# Altium project ESE516_A2_Thinking.PrjPcb (part 1 of 2)
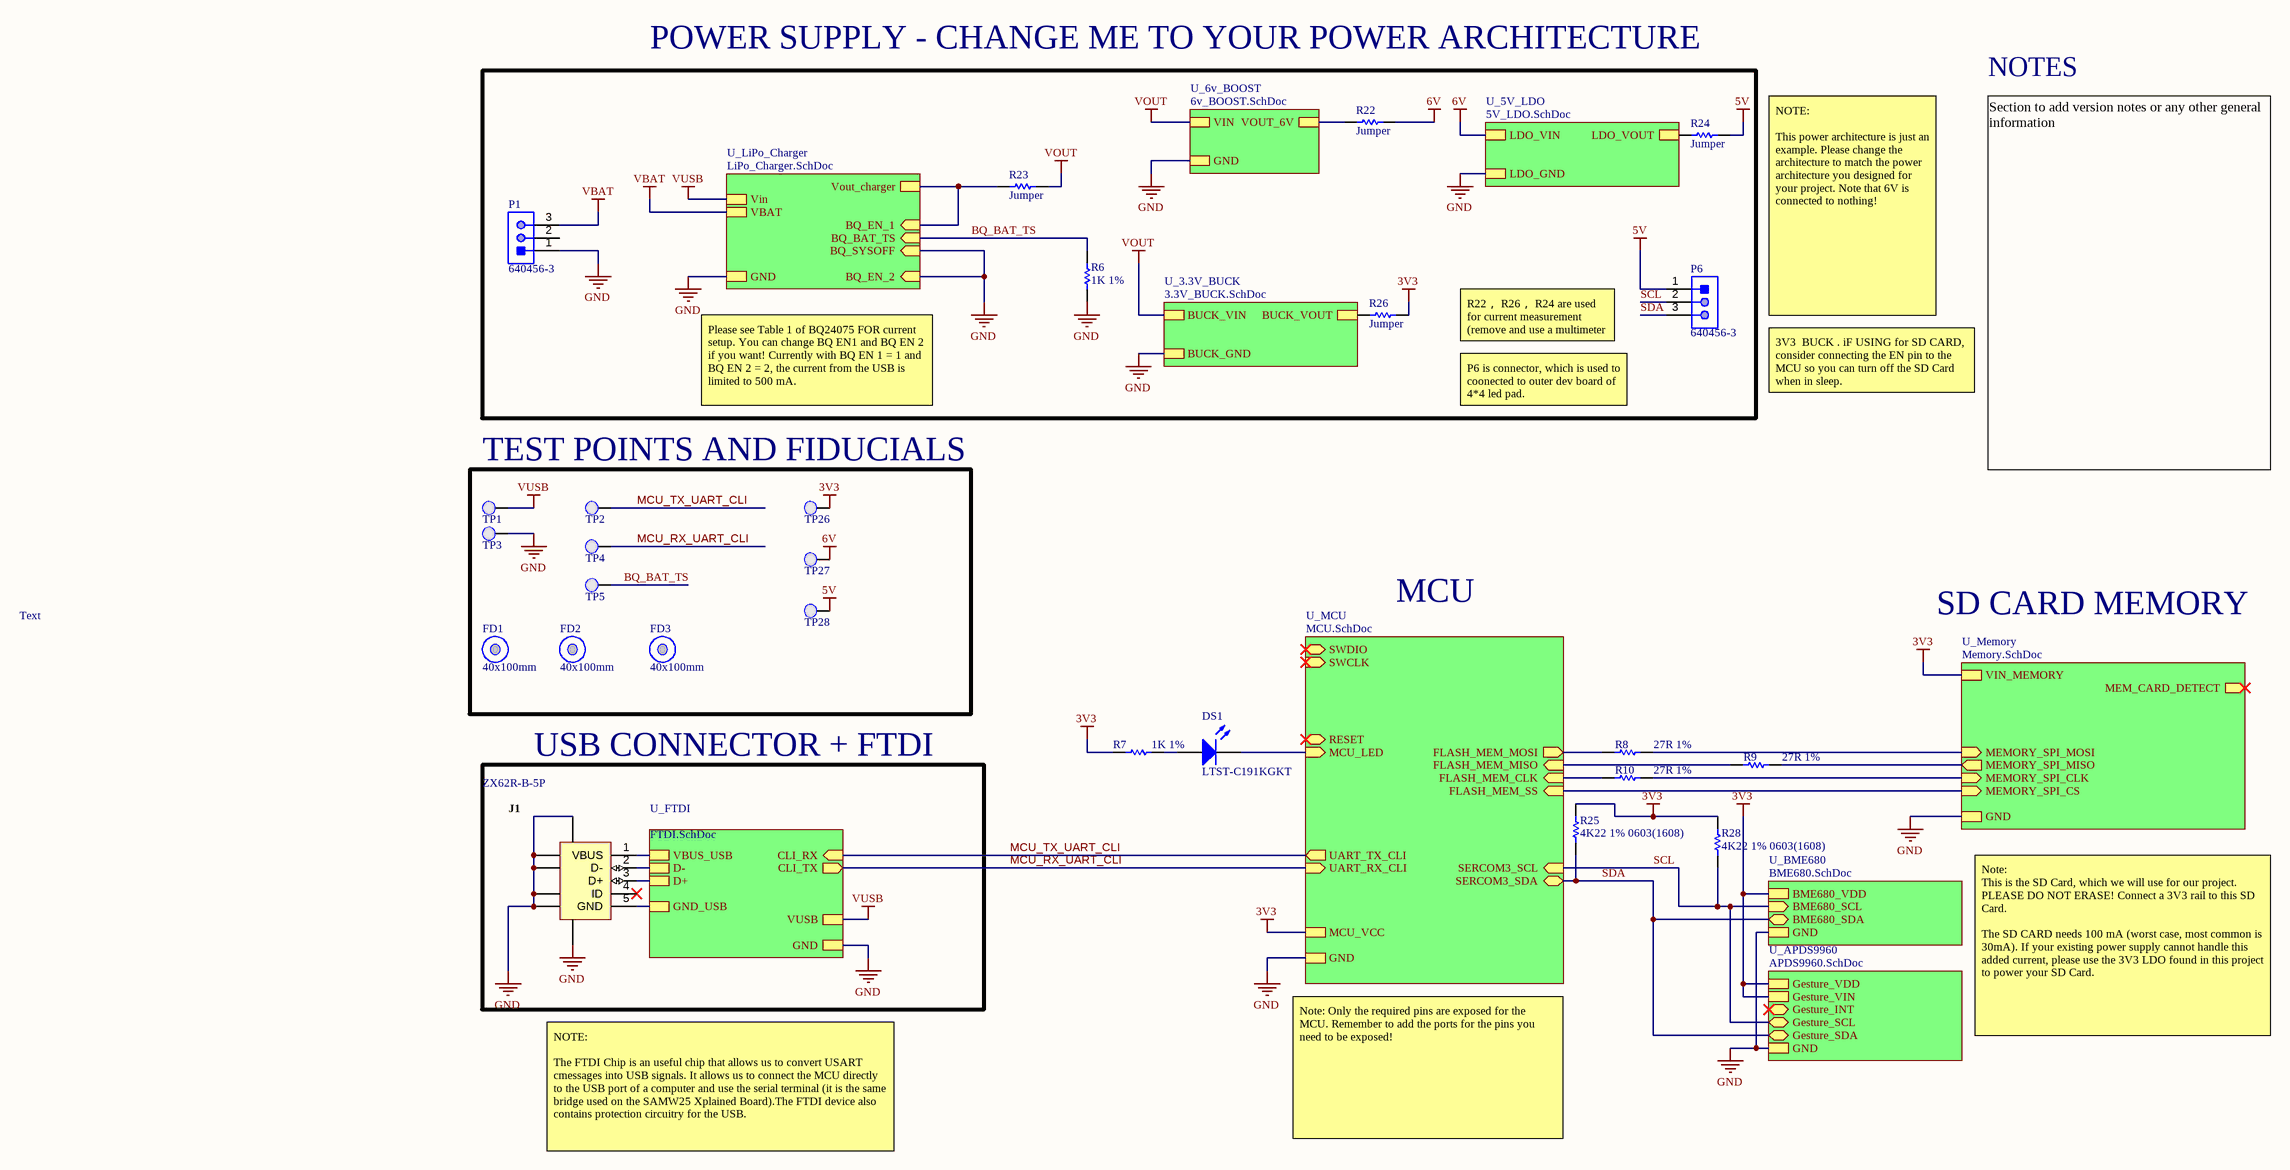
[diagram p0: MAIN.SchDoc]
10 sheets, 116 parts. Net scope: strictly hierarchical (ports join the sheet entries above them; power ports are local).
Board file: ESE516_PCB.PcbDoc
Sheets:
  MAIN.SchDoc
    U_FTDI = FTDI.SchDoc
    U_MCU = MCU.SchDoc
    U_Memory = Memory.SchDoc
    U_LiPo_Charger = LiPo_Charger.SchDoc
    U_6v_BOOST = 6v_BOOST.SchDoc
    U_BME680 = BME680.SchDoc
    U_APDS9960 = APDS9960.SchDoc
    U_3.3V_BUCK = 3.3V_BUCK.SchDoc
    U_5V_LDO = 5V_LDO.SchDoc

## Sheet MAIN.SchDoc: Main.SchDoc
size 558 x 431 mm; Date: 2/16/2022; Author: Xitong Zheng, Hongliang Chen; SheetNumber: 1; SheetTotal: 11

### Parts
DS1  LTST-C191KGKT  [LITE-ON-LTST-C191KRKT-2_V]
FD1  40x100mm  [Fiducial_FT]
FD2  40x100mm  [Fiducial_FT]
FD3  40x100mm  [Fiducial_FT]
J1  ZX62R-B-5P  [HIRO-ZX62R-B-5P_V]
P1  640456-3  [TECO-640456-3]
P6  640456-3  [TECO-640456-3]
R6  1K 1%  [RESC0603(1608)_N]
R7  1K 1%  [RESC0603(1608)_N]
R8  27R 1%  [RESC0603(1608)_N]
R9  27R 1%  [RESC0603(1608)_N]
R10  27R 1%  [RESC0603(1608)_N]
R22  Jumper  [RESC0805(2012)_N]
R23  Jumper  [RESC0805(2012)_N]
R24  Jumper  [RESC0805(2012)_N]
R25  4K22 1% 0603(1608)  [RESC0603(1608)_L]
R26  Jumper  [RESC0805(2012)_N]
R28  4K22 1% 0603(1608)  [RESC0603(1608)_L]
TP1  0.1" Pad  [PCBComponent]  (value not drawn)
TP2  0.1" Pad  [PCBComponent]  (value not drawn)
TP3  0.1" Pad  [PCBComponent]  (value not drawn)
TP4  0.1" Pad  [PCBComponent]  (value not drawn)
TP5  0.1" Pad  [PCBComponent]  (value not drawn)
TP26  0.1" Pad  [PCBComponent]  (value not drawn)
TP27  0.1" Pad  [PCBComponent]  (value not drawn)
TP28  0.1" Pad  [PCBComponent]  (value not drawn)

### Blocks framed on the sheet
POWER SUPPLY - CHANGE ME TO YOUR POWER ARCHITECTURE: P1 P6 R6 R22-R24 R26
TEST POINTS AND FIDUCIALS: FD1-FD3 TP1-TP5 TP26-TP28
USB CONNECTOR + FTDI: J1

### Sub-sheets
U_3.3V_BUCK = 3.3V_BUCK.SchDoc: BUCK_VIN, BUCK_GND, BUCK_VOUT
U_5V_LDO = 5V_LDO.SchDoc: LDO_VIN, LDO_GND, LDO_VOUT
U_6v_BOOST = 6v_BOOST.SchDoc: VIN, VOUT_6V, GND
U_APDS9960 = APDS9960.SchDoc: Gesture_VDD, Gesture_VIN, Gesture_INT (bidir), Gesture_SCL (bidir), Gesture_SDA (bidir), GND
U_BME680 = BME680.SchDoc: BME680_VDD, BME680_SDA (bidir), BME680_SCL (in), GND
U_FTDI = FTDI.SchDoc: CLI_RX (in), CLI_TX (out), VUSB, GND, VBUS_USB, D-, D+, GND_USB
U_LiPo_Charger = LiPo_Charger.SchDoc: BQ_EN_2 (in), BQ_SYSOFF (in), BQ_EN_1 (in), BQ_BAT_TS (in), Vin, GND, VBAT, Vout_charger
U_MCU = MCU.SchDoc: SWDIO (bidir), SWCLK (in), UART_TX_CLI (out), UART_RX_CLI (in), FLASH_MEM_SS (in), FLASH_MEM_CLK (in), FLASH_MEM_MISO (in), FLASH_MEM_MOSI (out), RESET (bidir), MCU_LED (in), MCU_VCC, GND, SERCOM3_SCL (in), SERCOM3_SDA (bidir)
U_Memory = Memory.SchDoc: MEMORY_SPI_MOSI (in), MEMORY_SPI_MISO (out), MEMORY_SPI_CLK (in), MEMORY_SPI_CS (in), MEM_CARD_DETECT (out), VIN_MEMORY, GND

### Nets
3V3: R7.1 R25.2 R26.2 R28.2 TP26.1(PAD) ; sheet U_MCU/MCU_VCC, sheet U_Memory/VIN_MEMORY, sheet U_BME680/BME680_VDD, sheet U_APDS9960/Gesture_VDD, sheet U_APDS9960/Gesture_VIN
5V: P6.1 R24.2 TP28.1(PAD)
6V: R22.2 TP27.1(PAD) ; sheet U_5V_LDO/LDO_VIN
6V_out: R22.1 ; sheet U_6v_BOOST/VOUT_6V
GND: J1.5(GND) J1.6(SHLD) J1.7(SHLD) J1.8(SHLD) J1.9(SHLD) J1.10(SHLD) J1.11(SHLD) P1.1 R6.2 TP3.1(PAD) ; sheet U_FTDI/GND, sheet U_FTDI/GND_USB, sheet U_MCU/GND, sheet U_Memory/GND, sheet U_LiPo_Charger/BQ_EN_2, sheet U_LiPo_Charger/BQ_SYSOFF, sheet U_LiPo_Charger/GND, sheet U_6v_BOOST/GND, sheet U_BME680/GND, sheet U_APDS9960/GND, sheet U_3.3V_BUCK/BUCK_GND, sheet U_5V_LDO/LDO_GND
VBAT: P1.3 ; sheet U_LiPo_Charger/VBAT
VBUS: J1.1(VBUS) ; sheet U_FTDI/VBUS_USB
VOUT: R23.2 ; sheet U_6v_BOOST/VIN, sheet U_3.3V_BUCK/BUCK_VIN
Vout_BQ: R23.1 ; sheet U_LiPo_Charger/BQ_EN_1, sheet U_LiPo_Charger/Vout_charger
VUSB: TP1.1(PAD) ; sheet U_FTDI/VUSB, sheet U_LiPo_Charger/Vin
A: R26.1 ; sheet U_3.3V_BUCK/BUCK_VOUT
BQ_BAT_TS: R6.1 TP5.1(PAD) ; sheet U_LiPo_Charger/BQ_BAT_TS
FLASH_MEM_SPI_SS: sheet U_MCU/FLASH_MEM_SS, sheet U_Memory/MEMORY_SPI_CS
LDO_VOUT: R24.1 ; sheet U_5V_LDO/LDO_VOUT
MCU_LED: DS1.2(K) ; sheet U_MCU/MCU_LED
MCU_RX_UART_CLI: TP4.1(PAD) ; sheet U_FTDI/CLI_TX, sheet U_MCU/UART_RX_CLI
MCU_TX_UART_CLI: TP2.1(PAD) ; sheet U_FTDI/CLI_RX, sheet U_MCU/UART_TX_CLI
MEM_SPI_CLK: R10.2 ; sheet U_Memory/MEMORY_SPI_CLK
MEM_SPI_MISO: R9.2 ; sheet U_Memory/MEMORY_SPI_MISO
MEM_SPI_MOSI: R8.2 ; sheet U_Memory/MEMORY_SPI_MOSI
SCL: P6.2 R28.1 ; sheet U_MCU/SERCOM3_SCL, sheet U_BME680/BME680_SCL, sheet U_APDS9960/Gesture_SCL
SDA: P6.3 R25.1 ; sheet U_MCU/SERCOM3_SDA, sheet U_BME680/BME680_SDA, sheet U_APDS9960/Gesture_SDA
SERCOM1_PAD2_SPI_MISO: R9.1 ; sheet U_MCU/FLASH_MEM_MISO
SERCOM1_PAD2_SPI_MOSI: R8.1 ; sheet U_MCU/FLASH_MEM_MOSI
SERCOM1_PAD3_SPI_SCK: R10.1 ; sheet U_MCU/FLASH_MEM_CLK
USB_DATA_N: J1.2(D-) ; sheet U_FTDI/D-
USB_DATA_P: J1.3(D+) ; sheet U_FTDI/D+
NetDS1_1: DS1.1(A) R7.2

Not connected (* = marked no-connect by the designer): J1 4(ID)*; P1 2

### Notes on the sheet
- NOTES
- R22， R26， R24 are used for current measurement (remove and use a multimeter in current model)
- NOTE:
  This power architecture is just an example. Please change the architecture to match the power architecture you designed for your project. Note that 6V is connected to nothing!
- Please see Table 1 of BQ24075 FOR current setup. You can change BQ EN1 and BQ EN 2 if you want! Currently with BQ EN 1 = 1 and BQ EN 2 = 2, the current from the USB is limited to 500 mA.
- P6 is connector, which is used to coonected to outer dev board of 4*4 led pad.
- 3V3  BUCK . iF USING for SD CARD, consider connecting the EN pin to the MCU so you can turn off the SD Card when in sleep.
- Section to add version notes or any other general information
- Text
- MCU
- SD CARD MEMORY
- Note:
  This is the SD Card, which we will use for our project. PLEASE DO NOT ERASE! Connect a 3V3 rail to this SD Card.
  The SD CARD needs 100 mA (worst case, most common is 30mA). If your existing power supply cannot handle this added current, please use the 3V3 LDO found in this project to power your SD Card.
- Note: Only the required pins are exposed for the MCU. Remember to add the ports for the pins you need to be exposed!
- NOTE:
  The FTDI Chip is an useful chip that allows us to convert USART cmessages into USB signals. It allows us to connect the MCU directly to the USB port of a computer and use the serial terminal (it is the same bridge used on the SAMW25 Xplained Board).The FTDI device also contains protection circuitry for the USB.
- DWG. NO.
- REV.
- SHT.
- REVISION
- DESCRIPTION
- DATE
- APPROVED
- THIS DOCUMENT AND THE DATA DISCLOSED HEREIN OR HEREWITH IS THE PROPERTY OF ALTIUM LIMITED AND MAY BE FREELY DISTRIBUTED IN WHOLE. NO RIGHTS ARE RESERVED OR EXPRESS OR IMPLIED WARANTEE GIVEN.
- ENG:
- DSN:
- APPROVALS
- PROJECT
- DOCUMENT REVISION:
- DESIGN ITEM:
- CHK:
- BOM:
- REFERENCE DOCUMENTS
- PROJECT REVISION:
- TITLE
- FAB DWG:
- PCB DWG:
- ASSY DWG:
- SCALE:
- SIZE
- C
- CAGE CODE
- FILE NAME
- DWG NO.
- SHEET
- OF
- REV

### Library data of the parts
DS1 = CMP-2000-05198-1: Chip LED, Green, 574 nm, 40 pF, -55 to 85 degC, 2-Pin SMD, RoHS, Tape and Reel; Manufacturer: Lite-On; Rad Hardened: No; Emitting Color: YellowGreen; Product Height (mm): 0.55mm; Forward Voltage: 2.4V; Number of Elements: 1; Dominant Wave Length: 571nm; DELETED: Compliant; Viewing Angle: 130deg; High Brightness: Yes; Peak Wavelength: 574nm; Type: Uni-Color; Forward Current: 30mA; Product Length (mm): 1.6mm; Luminous Intensity: 35mcd; Test Current (It): 20mA; Chip Material: AlGaInP; Product Depth (mm): 0.8mm; Shape Type: Rectangular; Reverse Voltage: 5V; Power Dissipation: 75W; Pin Count: 2; Lens Dimensions: 1.1X0.8X0.37mm; Packaging: TapeandReel; Main Category: ChipLED; Operating Temperature Classification: Industrial; Package Type: ChipLed; Mounting: SurfaceMount; Lum Intensity: 35mcd; Operating Temp Range: -55Cto85C; Datasheet Version: Jan-07; Datasheet URL: http://download.siliconexpert.com/pdfs/2007/08/26/semi_b/manual/lot/ds/ltst-c191kgkt.pdf; Manufacturer URL: http://www.us.liteon.com/
FD1-FD3 = CMP-00174-A.4: Fiducial 40x100mm
J1 = CMP-0031-00001-1: Connector; USBMicro-B,Reverse type, SMT; 5 Position; Right Angle; DatasheetVersion: 08/2010; Operating Temperature: -30 to 85 degC; Mounting Technology: Surface Mount; PartNumber: ZX62R-B-5P; PackageReference: ZX62R-B-5P; ComponentLink2URL: http://www.hirose.co.jp/cataloge_hp/e24200011.pdf; ComponentLink1URL: http://www.hirose.com/â€Ž; ComponentLink2Description: Datasheet; PackageDescription: 5-Pin USB Micro-B R/A Connector; ComponentLink1Description: Manufacturer URL
P1 P6 = CMP-2000-05418-1: Male Header, Pitch 2.54 mm, 1 x 3 Position, Height 10.03 mm, Tail Length 3.56 mm, -55 to 105 degC; Manufacturer: TE Connectivity; Agency Approvals: CSA,UL; Angle: Straight; Number of Positions: 3; Standards: RoHSCompliant,ELVCompliant,UL94V-0; Current, Rating: 5 / A; Connector Type: MTA-100; Mount Angle: Vertical; Material, Housing: Polyester; Temperature, Operating: -55to+105 / degC; Voltage, Rating: 250 / V; Color, Housing: White; Contact Centerline Spacing: 0.100 / in.; Special Features: Pinstrip; Material, Contact: CopperAlloy; Contact Termination Area Plating: Tin; Primary Type: InterconnectSystem; Pin Spacing: 0.1 / "; Brand/Series: MTA-100Series; Mounting Hole Size: 0.04 / "; Manufacturer URL: http://www.te.com/; Datasheet URL: https://datasheet.ciiva.com/16456/eng-ds-82056-mta-0608-16456886.pdf; Flammability Rating: UL94V-0; Mounting Type: PCMount; Contact Mating Area Plating: Tin; Datasheet Version: Jun-08; Number of Rows: 1; Termination: Solder; Type: PCBPlug; Length, Pin: 0.14 / "; Color: White; Contact Plating: Tin; Contact Shape: Square; Number of Contacts: 3; Size, Post: 0.025 / in.; Length, Terminal Post: 0.14 / in.; Length, Overall: 0.3 / "
R6 R7 = CMP-1012-00510-1: 1K 0.1W 1% 0603 (1608 Metric)  SMD; Case-Metric: 1608; Case-EIA: 0603; Value: 1000.00 Ohm; Technology: SMT; Tolerance: 1 %; Power: 0.1 W
R8-R10 = CMP-1012-00331-1: 27R 0.1W 1% 0603 (1608 Metric)  SMD; Case-EIA: 0603; Value: 27.00 Ohm; Case-Metric: 1608; Technology: SMT; Tolerance: 1 %; Power: 0.1 W
R22-R24 R26 = CMP-1013-00001-1: Jumper 0805 (2012 Metric); Case-EIA: 0805; Value: 0.00 Ohm; Tolerance: None; Case-Metric: 2012; Technology: SMT; Power: None
R25 R28 = CMP-1012-00580-1: 4K22 0.1W 1% 0603 (1608 Metric)  SMD; Case-EIA: 0603; Value: 4220.00 Ohm; Case-Metric: 1608; Power: 0.1 W; Tolerance: 1 %; Technology: SMT
TP1-TP5 TP26-TP28 = 0.1" Pad-A.4

## Sheet FTDI.SchDoc: FTDI.SchDoc
size 558 x 431 mm; Date: 2/16/2022; Author: Xitong Zheng, Hongliang Chen; SheetNumber: 8; SheetTotal: 11
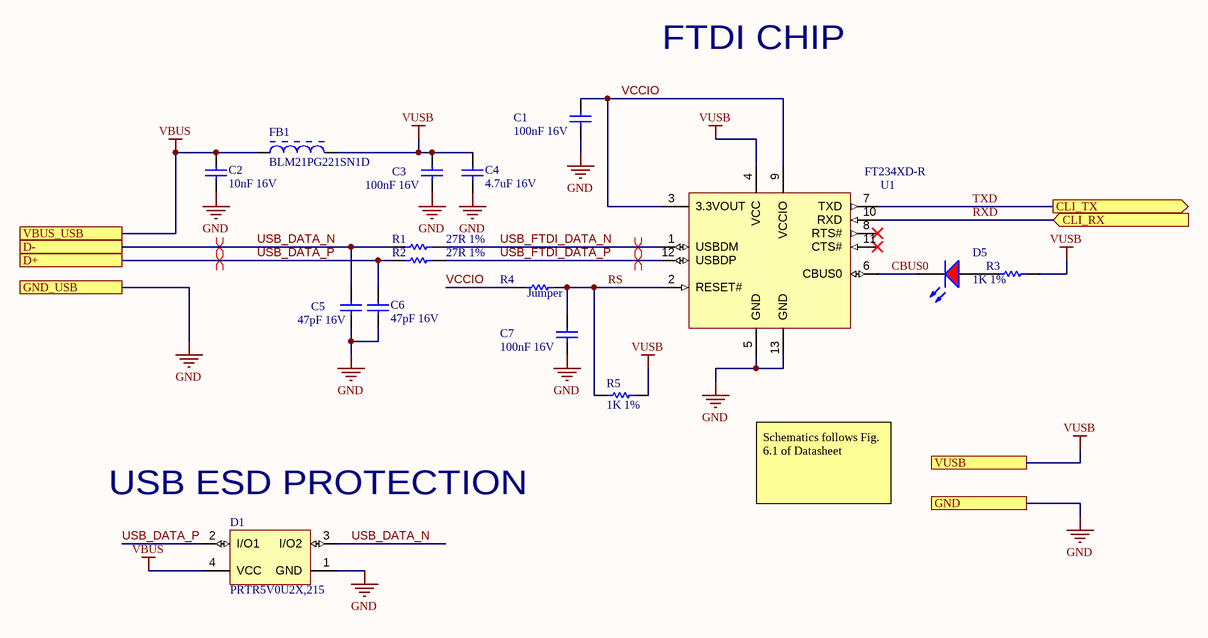
[diagram p1: FTDI.SchDoc]

### Parts
C1  100nF 16V  [CAPC0603(1608)100_N]
C2  10nF 16V  [CAPC0603(1608)100_N]
C3  100nF 16V  [CAPC0603(1608)100_N]
C4  4.7uF 16V  [CAPC0805(2012)145_N]
C5  47pF 16V  [CAPC0603(1608)100_N]
C6  47pF 16V  [CAPC0603(1608)100_N]
C7  100nF 16V  [CAPC0603(1608)100_N]
D1  PRTR5V0U2X,215  [NXP-SOT143B-4_V]
D5  LTST-C170CKT  [LTST-C170CKT_V]  (value not drawn)
FB1  BLM21PG221SN1D  [MURA-BLM21-B20-CHIP-2_V2]
R1  27R 1%  [RESC0603(1608)_N]
R2  27R 1%  [RESC0603(1608)_N]
R3  1K 1%  [RESC0603(1608)_N]
R4  Jumper  [RESC0603(1608)_N]
R5  1K 1%  [RESC0603(1608)_N]
U1  FT234XD-R  [DFN-12_V]

### Ports
CLI_RX (in), CLI_TX (out), D+, D-, GND, GND_USB, VBUS_USB, VUSB

### Nets
GND: C1.1 C2.1 C3.1 C4.1 C5.1 C6.1 C7.1 D1.1(GND) U1.5(GND) U1.13(GND) ; port GND, port GND_USB
VBUS: C2.2 D1.4(VCC) FB1.1 ; port VBUS_USB
VUSB: C3.2 C4.2 FB1.2 R3.2 R5.1 U1.4(VCC) ; port VUSB
CBUS0: D5.2(K) U1.6(CBUS0)
RS: C7.2 R4.2 R5.2 U1.2(RESET#)
RXD: U1.10(RXD) ; port CLI_RX  [project net MCU_TX_UART_CLI]
TXD: U1.7(TXD) ; port CLI_TX  [project net MCU_RX_UART_CLI]
USB_DATA_N: C5.2 D1.3(I/O2) R1.1 ; port D-
USB_DATA_P: C6.2 D1.2(I/O1) R2.1 ; port D+
USB_FTDI_DATA_N: R1.2 U1.1(USBDM)
USB_FTDI_DATA_P: R2.2 U1.12(USBDP)
VCCIO: C1.2 R4.1 U1.3(3.3VOUT) U1.9(VCCIO)
NetD5_1: D5.1(A) R3.1

Not connected (* = marked no-connect by the designer): U1 8(RTS#)* 11(CTS#)*

### Layout directives
differential pair: USB_DATA_N, USB_DATA_P, USB_FTDI_DATA_N, USB_FTDI_DATA_P

### Notes on the sheet
- FTDI CHIP
- (near D1) USB ESD PROTECTION
- Schematics follows Fig. 6.1 of Datasheet
- DWG. NO.
- REV.
- SHT.
- REVISION
- DESCRIPTION
- DATE
- APPROVED
- THIS DOCUMENT AND THE DATA DISCLOSED HEREIN OR HEREWITH IS THE PROPERTY OF ALTIUM LIMITED AND MAY BE FREELY DISTRIBUTED IN WHOLE. NO RIGHTS ARE RESERVED OR EXPRESS OR IMPLIED WARANTEE GIVEN.
- ENG:
- DSN:
- APPROVALS
- PROJECT
- DOCUMENT REVISION:
- DESIGN ITEM:
- CHK:
- BOM:
- REFERENCE DOCUMENTS
- PROJECT REVISION:
- TITLE
- FAB DWG:
- PCB DWG:
- ASSY DWG:
- SCALE:
- SIZE
- C
- CAGE CODE
- FILE NAME
- DWG NO.
- SHEET
- OF
- REV

### Library data of the parts
C1 C3 C7 = CMP-1035-02584-1: CAP 100nF 16V ±10% 0603 (1608 Metric) Thickness 1mm SMD; Tolerance: Â±10%; Case-EIA: 0603; Case-Metric: 1608; Technology: SMT; Max Thickness: 1 mm; Value: 100nF; Rated Voltage: 16 V
C2 = CMP-1035-02311-1: CAP 10nF 16V ±10% 0603 (1608 Metric) Thickness 1mm SMD; Case-EIA: 0603; Case-Metric: 1608; Tolerance: Â±10%; Rated Voltage: 16 V; Value: 10nF; Max Thickness: 1 mm; Technology: SMT
C4 = CMP-1036-04893-1: CAP 4.7uF 16V -20% to +80% 0805 (2012 Metric) Thickness 1.45mm SMD; Case-Metric: 2012; Case-EIA: 0805; Max Thickness: 1.45 mm; Value: 4.7uF; Rated Voltage: 16 V; Tolerance: -20% to +80%; Technology: SMT
C5 C6 = CMP-1035-01048-1: CAP 47pF 16V ±0.5pF 0603 (1608 Metric) Thickness 1mm SMD; Case-EIA: 0603; Case-Metric: 1608; Tolerance: Â±0.5pF; Technology: SMT; Value: 47pF; Rated Voltage: 16 V; Max Thickness: 1 mm
D1 = CMP-2000-05285-1: Ultra Low Capacitance Double Rail-to-Rail ESD Protection Diode, 5.5 V, 1 pF, -40 to 85 degC, 4-Pin SOT143B, RoHS, Tape and Reel; Manufacturer: NXP Semiconductors; Capacitance Value: 16pF; Number of Elements: 1; Rad Hardened: No; Reverse Breakdown Voltage: 6V; Working Voltage (Max): 5.5V; Polarity: Uni-Directional; Configuration: Quad; Leakage Current: 0.1uA; Product Height (mm): 1mm; Suppressor Type: DiodeArrays; Product Length (mm): 3mm; Product Depth (mm): 1.4mm; ESD Protection Voltage: 8KV@ContactDisc; Package Type: SOT; Mounting: SurfaceMount; Packaging: TapeandReel; Datasheet Version: Rev. 02, 01/2008; Reverse Stand-off Voltage: 5.5V; Manufacturer URL: http://www.nxp.com/; Operating Temp Range: -40Cto85C; Operating Temperature Classification: Industrial; Working Voltage: 5.5V; Operating Temperature Min Deg. C: -40C; Datasheet URL: https://datasheet.ciiva.com/4479/prtr5v0u2x-102853-4479461.pdf; Leakage Current (Max): 0.1uA; Direction Type: Uni-Directional; Pin Count: 3+Tab; Operating Temperature Max Deg. C: 85C; Mounting Style: SurfaceMount; Package / Case: SOT
D5 = CMP-1674-00001-5: LED Uni-Color Red, 100 mW, 200 mA, -55 to 85 degC, 2-Pin SMD, RoHS, Tape and Reel; Manufacturer: Lite-On; PackageReference: C170CKT; ComponentLink1Description: Manufacturer URL; ComponentLink1URL: http://www.us.liteon.com/; Package Quantity: 3000; Packaging: Tape and Reel; Pins: 2; ComponentLink2URL: http://media.digikey.com/pdf/Data%20Sheets/Lite-On%20PDFs/LTST-C170CKT.pdf; Max Operating Temperature: 85 degC; Min Operating Temperature: -55 degC; Mounting Technology: Surface Mount; Mount: Surface Mount; Length: 2 mm; ComponentLink2Description: Datasheet; DatasheetVersion: 03/2003; Height: 1.1 mm; PackageDescription: 2-Pin Surface Mount Device, Body 2 x 1.25 mm; RoHSCompliant: true; Colour: Red
FB1 = CMP-0686-00610-2: Chip Ferrite Bead for Power Lines, 220 Ohm, 2000 mA, -55 to 125 degC, 2 x 1.25 x 1.05 mm SMD, Tape and Reel; Manufacturer: Murata; DC Resistance: 0.045 Ohm Max.; Impedance (at 100 MHz): 220 Ohm +/- 25%; Rated Current: 2000 mA; PartNumber: BLM21PG221SN1D; Mounting Technology: Surface Mount; DatasheetVersion: 08/2013; ComponentLink3URL: http://www.murata.com/products/catalog/pdf/c31e.pdf; ComponentLink1URL: http://www.murata.com/; ComponentLink1Description: Manufacturer URL; ComponentLink2URL: http://www.murata.com/products/catalog/pdf/c31e.pdf; PackageDescription: 2-Pin Chip, Body 2 x 1.25 mm; ComponentLink3Description: Package Specification; Operating Temperature Range: -55 to 125 degC; Packing: Tape and Reel; ComponentLink2Description: Datasheet; PackageReference: BLM21_H1050-2
R1 R2 = CMP-1012-00331-1: as R8 on sheet MAIN; Technology: SMT; Tolerance: 1 %; Power: 0.1 W
R3 R5 = CMP-1012-00510-1: as R6 on sheet MAIN; Technology: SMT; Tolerance: 1 %; Power: 0.1 W
R4 = CMP-1012-00001-1: Jumper 0603 (1608 Metric); Case-Metric: 1608; Value: 0.00 Ohm; Power: None; Case-EIA: 0603; Technology: SMT; Tolerance: None
U1 = CMP-0248-00027-1: FT234XD USB to BASIC UART IC, -40 to +85 degC, 12-Pin DFN, Pb-Free, Tape and Reel; Manufacturer: FTDI; PackageReference: DFN-12; PackageVersion: Feb-13; DatasheetVersion: ver 1.1, Feb-2013; ComponentLink1URL: http://www.ftdichip.com/; PartNumber: FT234XD-R; ComponentLink2URL: http://www.ftdichip.com/Support/Documents/DataSheets/ICs/DS_FT234XD.pdf; ComponentLink1Description: Manufacturer URL; PackageDescription: 12-Pin Dual Flat No-Lead, 3 x 3 mm Body, 0.45 mm Pitch, Exposed Pad; ComponentLink2Description: Datasheet

## Sheet MCU.SchDoc: MCU.SchDoc
size 558 x 431 mm; Date: 2/16/2022; Author: Xitong Zheng, Hongliang Chen; SheetNumber: 7; SheetTotal: 11
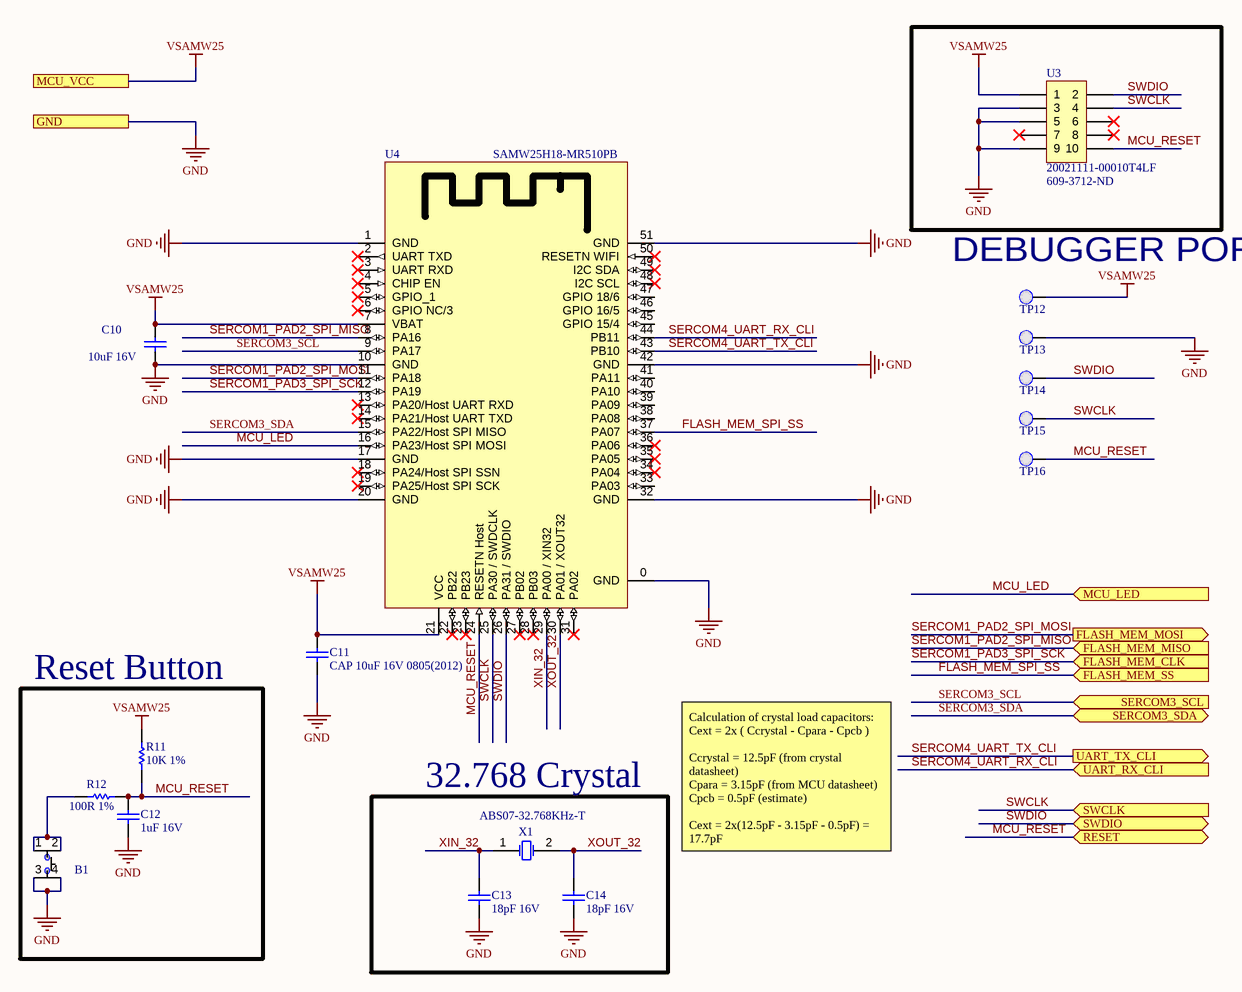
[diagram p2: MCU.SchDoc]

### Parts
B1  PTS810 SJK 250 SMTR LFS  [PTS810 SJK 250 SMTR LFS]  (value not drawn)
C10  10uF 16V  [CAPC0805(2012)145_N]
C11  CAP 10uF 16V 0805(2012)  [CAPC0805(2012)145_N]
C12  1uF 16V  [CAPC0603(1608)100_N]
C13  18pF 16V  [CAPC0603(1608)100_N]
C14  18pF 16V  [CAPC0603(1608)100_N]
R11  10K 1%  [RESC0603(1608)_N]
R12  100R 1%  [RESC0603(1608)_N]
TP12  0.1" Pad  [PCBComponent]  (value not drawn)
TP13  0.1" Pad  [PCBComponent]  (value not drawn)
TP14  0.1" Pad  [PCBComponent]  (value not drawn)
TP15  0.1" Pad  [PCBComponent]  (value not drawn)
TP16  0.1" Pad  [PCBComponent]  (value not drawn)
U3  20021111-00010T4LF  Supplier Part Number 1: 609-3712-ND  [20021111-00010T4LF]
U4  SAMW25H18-MR510PB  [SAMW25H18-MR510PB]
X1  ABS07-32.768KHz-T  [ABRA-ABS07-2_V]

### Blocks framed on the sheet
Reset Button: B1 C12 R11 R12
32.768 Crystal: C13 C14 X1

### Ports
FLASH_MEM_CLK (in), FLASH_MEM_MISO (in), FLASH_MEM_MOSI (out), FLASH_MEM_SS (in), GND, MCU_LED (in), MCU_VCC, RESET (bidir), SERCOM3_SCL (in), SERCOM3_SDA (bidir), SWCLK (in), SWDIO (bidir), UART_RX_CLI (in), UART_TX_CLI (out)

### Nets
GND: B1.3 B1.4 C10.1 C11.1 C12.1 C13.1 C14.1 TP13.1(PAD) U3.3 U3.5 U3.9 U4.0(GND) U4.1(GND) U4.10(GND) U4.17(GND) U4.20(GND) U4.32(GND) U4.42(GND) U4.51(GND) ; port GND
VSAMW25: C10.2 C11.2 R11.2 TP12.1(PAD) U3.1 U4.7(VBAT) U4.21(VCC) ; port MCU_VCC  [project net 3V3]
FLASH_MEM_SPI_SS: U4.37(PA07) ; port FLASH_MEM_SS
MCU_LED: U4.16(PA23/Host_SPI_MOSI) ; port MCU_LED
MCU_RESET: C12.2 R11.1 R12.2 TP16.1(PAD) U3.10 U4.24(RESETN_Host) ; port RESET
SERCOM1_PAD2_SPI_MISO: U4.8(PA16) ; port FLASH_MEM_MISO
SERCOM1_PAD2_SPI_MOSI: U4.11(PA18) ; port FLASH_MEM_MOSI
SERCOM1_PAD3_SPI_SCK: U4.12(PA19) ; port FLASH_MEM_CLK
SERCOM3_SCL: U4.9(PA17) ; port SERCOM3_SCL  [project net SCL]
SERCOM3_SDA: U4.15(PA22/Host_SPI_MISO) ; port SERCOM3_SDA  [project net SDA]
SERCOM4_UART_RX_CLI: U4.44(PB11) ; port UART_RX_CLI  [project net MCU_RX_UART_CLI]
SERCOM4_UART_TX_CLI: U4.43(PB10) ; port UART_TX_CLI  [project net MCU_TX_UART_CLI]
SWCLK: TP15.1(PAD) U3.4 U4.25(PA30_/_SWDCLK) ; port SWCLK
SWDIO: TP14.1(PAD) U3.2 U4.26(PA31_/_SWDIO) ; port SWDIO
XIN_32: C13.2 U4.29(PA00_/_XIN32) X1.1(X1)
XOUT_32: C14.2 U4.30(PA01_/_XOUT32) X1.2(X2)
NetB1_1: B1.1 B1.2 R12.1

Not connected (* = marked no-connect by the designer): U3 6* 7* 8*; U4 2(UART_TXD)* 3(UART_RXD)* 4(CHIP_EN)* 5(GPIO_1)* 6(GPIO_NC/3)* 13(PA20/Host_UART_RXD)* 14(PA21/Host_UART_TXD)* 18(PA24/Host_SPI_SSN)* 19(PA25/Host_SPI_SCK)* 22(PB22)* 23(PB23)* 27(PB02)* 28(PB03)* 31(PA02)* 33(PA03) 34(PA04)* 35(PA05)* 36(PA06)* 38(PA08) 39(PA09) 40(PA10) 41(PA11) 45(GPIO_15/4) 46(GPIO_16/5) 47(GPIO_18/6) 48(I2C_SCL)* 49(I2C_SDA)* 50(RESETN_WIFI)*

### Notes on the sheet
- (near TP12) DEBUGGER PORT
- Calculation of crystal load capacitors:
  Cext = 2x ( Ccrystal - Cpara - Cpcb )
  Ccrystal = 12.5pF (from crystal datasheet)
  Cpara = 3.15pF (from MCU datasheet)
  Cpcb = 0.5pF (estimate)
  Cext = 2x(12.5pF - 3.15pF - 0.5pF) = 17.7pF
- DWG. NO.
- REV.
- SHT.
- REVISION
- DESCRIPTION
- DATE
- APPROVED
- THIS DOCUMENT AND THE DATA DISCLOSED HEREIN OR HEREWITH IS THE PROPERTY OF ALTIUM LIMITED AND MAY BE FREELY DISTRIBUTED IN WHOLE. NO RIGHTS ARE RESERVED OR EXPRESS OR IMPLIED WARANTEE GIVEN.
- ENG:
- DSN:
- APPROVALS
- PROJECT
- DOCUMENT REVISION:
- DESIGN ITEM:
- CHK:
- BOM:
- REFERENCE DOCUMENTS
- PROJECT REVISION:
- TITLE
- FAB DWG:
- PCB DWG:
- ASSY DWG:
- SCALE:
- SIZE
- C
- CAGE CODE
- FILE NAME
- DWG NO.
- SHEET
- OF
- REV

### Library data of the parts
B1 = PTS810 SJK 250 SMTR LFS: SWITCH TACTILE SPST-NO 0.05A 16V Tactile Switch SPST-NO Top Actuated Surface Mount; Manufacturer: ITT /  C&K Components; Part # Aliases: Y97LT25B5DBFP; Operating Force: 2.6 N; Actuator: Oval; Current Rating: 50 mA; Voltage Rating DC: 16 VDC; Contact Form: SPST; Switch Function: OFF - (ON); Mounting Direction: Straight; Stem Height: 2.5 mm; Brand: C&K Components; Travel: 0.15 mm; Manufacturer Part Number: PTS810SJK250SMTRLFS; Product Category: Tactile Switches; RoHS: Details; Termination Style: J Form Lead; Mounting Style: SMD/SMT; Color: White; Packaging: Reel; Contact Plating: Silver; Operating Temperature Range: - 40 C to + 85 C; Series: PTS810; Factory Pack Quantity: 2900; ComponentLink1URL: https://datasheet.ciiva.com/18514/pts810-4mar13-18514061.pdf; ComponentLink1Description: https://datasheet.ciiva.com/18514/pts810-4mar13-18514061.pdf; ComponentLink2URL: https://datasheet.ciiva.com/18514/pts810-4mar13-18514062.pdf; ComponentLink2Description: https://datasheet.ciiva.com/18514/pts810-4mar13-18514062.pdf; ComponentLink3URL: https://datasheet.ciiva.com/18514/pts810-4mar13-18514063.pdf; ComponentLink3Description: https://datasheet.ciiva.com/18514/pts810-4mar13-18514063.pdf; Supplier 1: Digi-Key; Supplier Part Number 1: CKN10503CT-ND
C10 C11 = CMP-1036-04927-1: CAP 10uF 16V ±10% 0805 (2012 Metric) Thickness 1.45mm SMD; Case-EIA: 0805; Tolerance: Â±10%; Case-Metric: 2012; Rated Voltage: 16 V; Technology: SMT; Value: 10uF; Max Thickness: 1.45 mm
C12 = CMP-1035-02736-1: CAP 1uF 16V ±5% 0603 (1608 Metric) Thickness 1mm SMD; Case-Metric: 1608; Case-EIA: 0603; Tolerance: Â±5%; Technology: SMT; Max Thickness: 1 mm; Rated Voltage: 16 V; Value: 1uF
C13 C14 = CMP-1035-00738-1: CAP 18pF 16V ±5% 0603 (1608 Metric) Thickness 1mm SMD; Tolerance: Â±5%; Case-EIA: 0603; Case-Metric: 1608; Max Thickness: 1 mm; Rated Voltage: 16 V; Value: 18pF; Technology: SMT
R11 = CMP-1012-00623-1: 10K 0.1W 1% 0603 (1608 Metric)  SMD; Value: 10000.00 Ohm; Case-EIA: 0603; Case-Metric: 1608; Power: 0.1 W; Tolerance: 1 %; Technology: SMT
R12 = CMP-1012-00397-1: 100R 0.1W 1% 0603 (1608 Metric)  SMD; Value: 100.00 Ohm; Case-EIA: 0603; Case-Metric: 1608; Technology: SMT; Tolerance: 1 %; Power: 0.1 W
TP12-TP16 = 0.1" Pad-A.4
U3 = 20021111-00010T4LF: CONN HEADER 10POS UNSHD VERT T/H; Manufacturer: Amphenol / FCI; Stack Height: 2.5 mm; Number of Positions / Contacts: 10; Brand: FCI; Pitch: 1.27 mm; Mounting Angle: Vertical; Current Rating: 10 A; Mating Post Length: 3.05 mm; Voltage Rating: 125 V; Manufacturer Part Number: 20021111-00010T4LF; Mounting Style: Through Hole; Product Category: Headers & Wire Housings; RoHS: Details; Series: Minitek; Product Type: Headers; Type: Unshrouded; Number of Positions: 10; Number of Rows: 2; Contact Plating: Gold; Housing Material: Plastic; Termination Style: Through Hole; Contact Material: Nickel; Packaging: Tube; Factory Pack Quantity: 93; Termination Post Length: 2.3 mm; ComponentLink1URL: https://datasheet.ciiva.com/1433/1079612-1433267.pdf; ComponentLink1Description: https://datasheet.ciiva.com/1433/1079612-1433267.pdf; ComponentLink2URL: https://datasheet.ciiva.com/409/20021111-409158.pdf; ComponentLink2Description: https://datasheet.ciiva.com/409/20021111-409158.pdf; ComponentLink3URL: https://datasheet.ciiva.com/5131/20021111-5131386.pdf; ComponentLink3Description: https://datasheet.ciiva.com/5131/20021111-5131386.pdf; ComponentLink4URL: https://datasheet.ciiva.com/9465/20021111-9465402.pdf; ComponentLink4Description: https://datasheet.ciiva.com/9465/20021111-9465402.pdf; Supplier 1: Digi-Key
U4 = SAMW25H18-MR510PB: RF TXRX MODULE WIFI TRACE ANT; Manufacturer: Atmel; Manufacturer Part Number: ATSAMW25H18-MR510PB; Protocol: 802.11b/g/n; Frequency: 2.4GHz; Data Rate: 65Mbps; Power - Output: 17dBm; Sensitivity: -95.5dBm; Serial Interfaces: SPI, UART; Antenna Type: Integrated, Trace; Memory Size: 256kB Flash, 32kB SRAM; Voltage - Supply: 2.7 V ~ 4.2 V; Category: RF/IF and RFID; Family: RF Transceiver Modules; Series: Xplained Pro; Packaging: Tray; RF Family/Standard: WiFi; Modulation: -; Current - Receiving: -; Current - Transmitting: -; Mounting Type: Surface Mount; Operating Temperature: -40°C ~ 85°C; Package / Case: Module; ComponentLink1URL: http://www.atmel.com/devices/ATSAMW25.aspx; ComponentLink1Description: http://www.atmel.com/devices/ATSAMW25.aspx; ComponentLink2URL: http://www.farnell.com/datasheets/1965115.pdf; ComponentLink2Description: http://www.farnell.com/datasheets/1965115.pdf; Supplier 1: Digikey; Stock 1: 120; Pricing 1: 1=19.14 (USD); Supplier Part Number 1: ATSAMW25H18-MR510PB-ND
X1 = CMP-0447-00001-2: Crystal, 32.768 kHz, 12.5 pF, -40 to 85 degC, SMD Low Profile 3.2 x 1.5 x 0.9 mm, Tape and Reel; Manufacturer: Abracon; Q Value (Type): 30000; Operation Mode: Flexural Mode (Tuning Fork); Shunt Capacitance (C0): 0.9 to 1.2 pF; Load Capacitance (CL): 12.5 pF; Frequency Tolerance @+25degC: +/- 20 ppm; Drive Level (Type): 0.1 uW; Equivalent Series Resistance (R1): 70 Kohm; Insulation Resistance (Min): 500 Mohm; ComponentLink3URL: http://www.abracon.com/Resonators/ABS07.pdf; PackageDescription: 2-Pin Hand Drawn, Body 3.2x1.5mm, Pitch 2.5mm; Operating Temperature: -40 to 85 degC; ComponentLink2URL: http://www.abracon.com/Resonators/ABS07.pdf; PackageReference: ABS07-2; ComponentLink3Description: Package Specification; ComponentLink1Description: Manufacturer URL; DatasheetVersion: 04.03.13; Mounting Technology: Surface Mount; ComponentLink2Description: Datasheet; ComponentLink1URL: http://www.abracon.com/; PartNumber: ABS07-32.768KHz-T; Packing: Tape and Reel; Frequency: 32.768 kHz

## Sheet Memory.SchDoc: Memory.SchDoc
size 558 x 431 mm; Date: 2/16/2022; Author: Xitong Zheng, Hongliang Chen; SheetNumber: 6; SheetTotal: 11
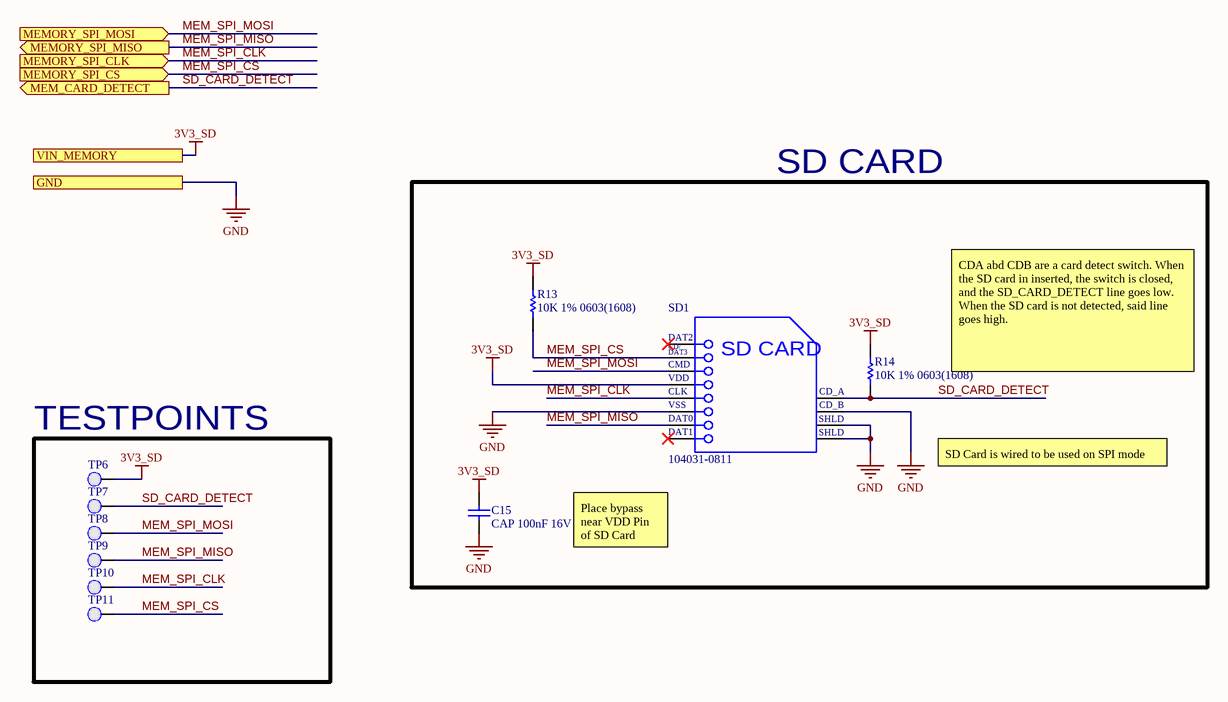
[diagram p3: Memory.SchDoc]

### Parts
C15  CAP 100nF 16V 0603(1608)  [CAPC0603(1608)100_N]
R13  10K 1% 0603(1608)  [RESC0603(1608)_N]
R14  10K 1% 0603(1608)  [RESC0603(1608)_N]
SD1  104031-0811  [MOLX-104031-0811_V]
TP6  0.1" Pad  [PCBComponent]  (value not drawn)
TP7  0.1" Pad  [PCBComponent]  (value not drawn)
TP8  0.1" Pad  [PCBComponent]  (value not drawn)
TP9  0.1" Pad  [PCBComponent]  (value not drawn)
TP10  0.1" Pad  [PCBComponent]  (value not drawn)
TP11  0.1" Pad  [PCBComponent]  (value not drawn)

### Blocks framed on the sheet
SD CARD: C15 R13 R14 SD1
TESTPOINTS: TP6-TP11

### Ports
GND, MEM_CARD_DETECT (out), MEMORY_SPI_CLK (in), MEMORY_SPI_CS (in), MEMORY_SPI_MISO (out), MEMORY_SPI_MOSI (in), VIN_MEMORY

### Nets
3V3_SD: C15.2 R13.2 R14.2 SD1.4(VDD) TP6.1(PAD) ; port VIN_MEMORY  [project net 3V3]
GND: C15.1 SD1.6(VSS2) SD1.10(CD_B) SD1.11(SHLD1) SD1.12(SHLD2) ; port GND
MEM_SPI_CLK: SD1.5(CLK) TP10.1(PAD) ; port MEMORY_SPI_CLK
MEM_SPI_CS: R13.1 SD1.2(CMD) TP11.1(PAD) ; port MEMORY_SPI_CS  [project net FLASH_MEM_SPI_SS]
MEM_SPI_MISO: SD1.7(DAT0) TP9.1(PAD) ; port MEMORY_SPI_MISO
MEM_SPI_MOSI: SD1.3(VSS1) TP8.1(PAD) ; port MEMORY_SPI_MOSI
SD_CARD_DETECT: R14.1 SD1.9(CD_A) TP7.1(PAD) ; port MEM_CARD_DETECT

Not connected (* = marked no-connect by the designer): SD1 1(CD/DAT3)* 8(DAT1)*

### Notes on the sheet
- CDA abd CDB are a card detect switch. When the SD card in inserted, the switch is closed, and the SD_CARD_DETECT line goes low. When the SD card is not detected, said line goes high.
- SD Card is wired to be used on SPI mode
- Place bypass near VDD Pin of SD Card
- DWG. NO.
- REV.
- SHT.
- REVISION
- DESCRIPTION
- DATE
- APPROVED
- THIS DOCUMENT AND THE DATA DISCLOSED HEREIN OR HEREWITH IS THE PROPERTY OF ALTIUM LIMITED AND MAY BE FREELY DISTRIBUTED IN WHOLE. NO RIGHTS ARE RESERVED OR EXPRESS OR IMPLIED WARANTEE GIVEN.
- ENG:
- DSN:
- APPROVALS
- PROJECT
- DOCUMENT REVISION:
- DESIGN ITEM:
- CHK:
- BOM:
- REFERENCE DOCUMENTS
- PROJECT REVISION:
- TITLE
- FAB DWG:
- PCB DWG:
- ASSY DWG:
- SCALE:
- SIZE
- C
- CAGE CODE
- FILE NAME
- DWG NO.
- SHEET
- OF
- REV
- (in symbol CMP-2000-05825-1) DAT2; CD/; DAT3; SD CARD; VSS; SHLD

### Library data of the parts
C15 = CMP-1035-02584-1: as C1 on sheet FTDI; Technology: SMT; Max Thickness: 1 mm; Value: 100nF; Rated Voltage: 16 V
R13 R14 = CMP-1012-00623-1: as R11 on sheet MCU; Power: 0.1 W; Tolerance: 1 %; Technology: SMT
SD1 = CMP-2000-05825-1: Micro SD Card, RA, -25 to 85 degC, 8-Pin SMD, RoHS, Tape and Reel; Voltage Rating: 10VAC/DC; Number of Contacts: 8; Insertion - Extraction Style: Push-Pull; Pitch: 1.1mm; Mating Cycles: 10000; Brand: Molex; Current Rating: 500mA; Manufacturer URL: http://www.molex.com/; Card Type: microSD; Mounting Type: Standard; Height: 1.42mm; Mounting Technology: SurfaceMount; Contact Plating: Gold; Product Category: MemoryCardConnectors; Package Description: 8-Pin Surface Mount Device, Body 11.95 x 11.4 mm, Pitch 1.1 mm; Datasheet URL: http://www.molex.com/pdm_docs/sd/1040310811_sd.pdf; Termination Style: SMD; Length: 11.4mm; Housing Material: LiquidCrystalPolymer(LCP); Orientation: RightAngle; RoHS: True; Contact Material: PhosphorBronze; Datasheet Version: Rev. E, 04/2006; Packaging: Reel; Manufacturer: Molex; Series: 104031; Product: CardConnectors; Number of Rows: 1Row; Package Reference: 104031-0811
TP6-TP11 = 0.1" Pad-A.4

## Sheet LiPo_Charger.SchDoc: LiPo_Charger.SchDoc
size 558 x 431 mm; Date: 2/16/2022; Author: Xitong Zheng, Hongliang Chen; SheetNumber: 9; SheetTotal: 11
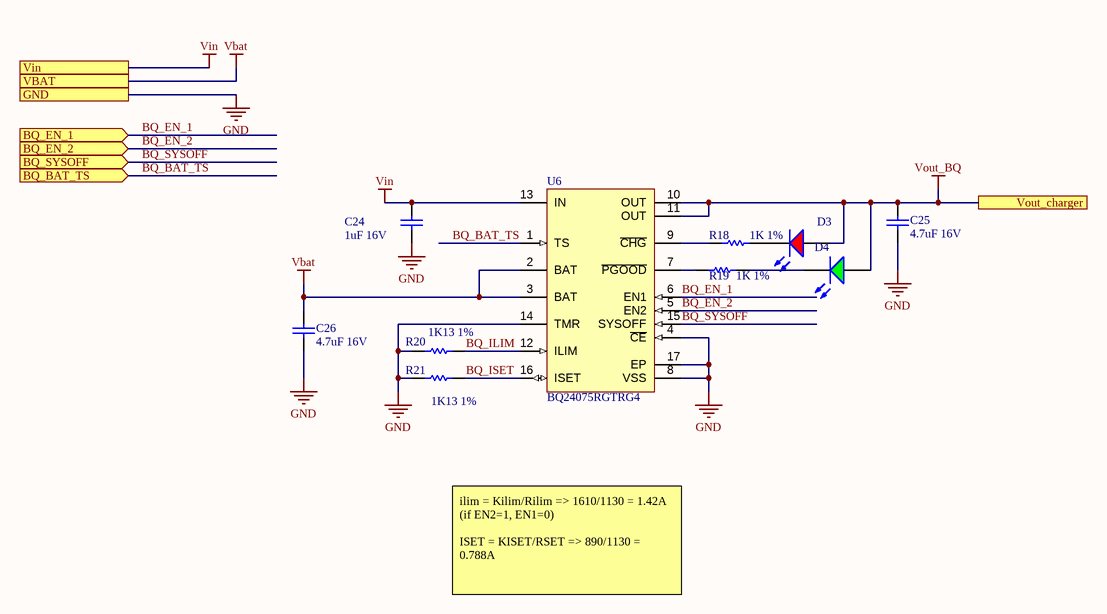
[diagram p4: LiPo_Charger.SchDoc]

### Parts
C24  1uF 16V  [CAPC0603(1608)100_N]
C25  4.7uF 16V  [CAPC0805(2012)145_N]
C26  4.7uF 16V  [CAPC0805(2012)145_N]
D3  LTST-C170CKT  [LTST-C170CKT_V]  (value not drawn)
D4  LTST-C170GKT  [LTST-C170GKT_V]  (value not drawn)
R18  1K 1%  [RESC0603(1608)_N]
R19  1K 1%  [RESC0603(1608)_N]
R20  1K13 1%  [RESC0603(1608)_N]
R21  1K13 1%  [RESC0603(1608)_N]
U6  BQ24075RGTRG4  [RGT16-1700X1700TP]

### Ports
BQ_BAT_TS (in), BQ_EN_1 (in), BQ_EN_2 (in), BQ_SYSOFF (in), GND, VBAT, Vin, Vout_charger

### Nets
GND: C24.1 C25.1 C26.2 R20.1 R21.1 U6.4(~{CE}) U6.5(EN2) U6.8(VSS) U6.14(TMR) U6.15(SYSOFF) U6.17(EP) ; port BQ_EN_2, port BQ_SYSOFF, port GND  [also labelled BQ_EN_2, BQ_SYSOFF]
VBAT: C26.1 U6.2(BAT) U6.3(BAT) ; port VBAT
Vin: C24.2 U6.13(IN) ; port Vin  [project net VUSB]
Vout_BQ: C25.2 D3.1(A) D4.1(A) U6.6(EN1) U6.10(OUT) U6.11(OUT) ; port BQ_EN_1, port Vout_charger  [also labelled BQ_EN_1]
BQ_BAT_TS: U6.1(TS) ; port BQ_BAT_TS
BQ_ILIM: R20.2 U6.12(ILIM)
BQ_ISET: R21.2 U6.16(ISET)
NetD3_2: D3.2(K) R18.2
NetD4_2: D4.2(K) R19.2
NetR18_1: R18.1 U6.9(~{CHG})
NetR19_1: R19.1 U6.7(~{PGOOD})

### Notes on the sheet
- ilim = Kilim/Rilim => 1610/1130 = 1.42A (if EN2=1, EN1=0)
  ISET = KISET/RSET => 890/1130 = 0.788A
- DWG. NO.
- REV.
- SHT.
- REVISION
- DESCRIPTION
- DATE
- APPROVED
- THIS DOCUMENT AND THE DATA DISCLOSED HEREIN OR HEREWITH IS THE PROPERTY OF ALTIUM LIMITED AND MAY BE FREELY DISTRIBUTED IN WHOLE. NO RIGHTS ARE RESERVED OR EXPRESS OR IMPLIED WARANTEE GIVEN.
- ENG:
- DSN:
- APPROVALS
- PROJECT
- DOCUMENT REVISION:
- DESIGN ITEM:
- CHK:
- BOM:
- REFERENCE DOCUMENTS
- PROJECT REVISION:
- TITLE
- FAB DWG:
- PCB DWG:
- ASSY DWG:
- SCALE:
- SIZE
- C
- CAGE CODE
- FILE NAME
- DWG NO.
- SHEET
- OF
- REV

### Library data of the parts
C24 = CMP-1035-02736-1: as C12 on sheet MCU; Technology: SMT; Max Thickness: 1 mm; Rated Voltage: 16 V; Value: 1uF
C25 C26 = CMP-1036-04893-1: as C4 on sheet FTDI; Max Thickness: 1.45 mm; Value: 4.7uF; Rated Voltage: 16 V; Tolerance: -20% to +80%; Technology: SMT
D3 = CMP-1674-00001-5: as D5 on sheet FTDI; PackageReference: C170CKT; ComponentLink1Description: Manufacturer URL; ComponentLink1URL: http://www.us.liteon.com/; Package Quantity: 3000; Packaging: Tape and Reel; Pins: 2; ComponentLink2URL: http://media.digikey.com/pdf/Data%20Sheets/Lite-On%20PDFs/LTST-C170CKT.pdf; Max Operating Temperature: 85 degC; Min Operating Temperature: -55 degC; Mounting Technology: Surface Mount; Mount: Surface Mount; Length: 2 mm; ComponentLink2Description: Datasheet; DatasheetVersion: 03/2003; Height: 1.1 mm; PackageDescription: 2-Pin Surface Mount Device, Body 2 x 1.25 mm; RoHSCompliant: true; Colour: Red
D4 = CMP-1674-00002-5: LED Uni-Color Green, 100 mW, 120 mA, -55 to 85 degC, 2-Pin SMD, RoHS, Tape and Reel; Manufacturer: Lite-On; PackageReference: C170GKT; ComponentLink1Description: Manufacturer URL; ComponentLink1URL: http://www.us.liteon.com/; Height: 1.1 mm; PackageDescription: 2-Pin Surface Mount Device, Body 2 x 1.25 mm; RoHSCompliant: true; Package Quantity: 1; Packaging: Tape and Reel; Mount: Surface Mount; Min Operating Temperature: -55 degC; DatasheetVersion: 03/2003; Max Operating Temperature: 85 degC; Pins: 2; Mounting Technology: Surface Mount; Length: 2 mm; Colour: Green; ComponentLink2URL: http://media.digikey.com/pdf/Data%20Sheets/Lite-On%20PDFs/LTST-C170GKT.pdf; ComponentLink2Description: Datasheet
R18 R19 = CMP-1012-00510-1: as R6 on sheet MAIN; Technology: SMT; Tolerance: 1 %; Power: 0.1 W
R20 R21 = CMP-1012-00515-1: 1K13 0.1W 1% 0603 (1608 Metric)  SMD; Value: 1130.00 Ohm; Case-EIA: 0603; Case-Metric: 1608; Power: 0.1 W; Tolerance: 1 %; Technology: SMT
U6 = CMP-0321-00237-1: USB-Friendly Li-Ion Battery Charger and Power-Path Management IC, Vout 5.5 V, 4.3 V, -40 to 85 degC, 16-pin QFN (RGT), Green (RoHS & no Sb/Br); Manufacturer: Texas Instruments; Li-Ion: N; SubFamily: Battery Charge Management; Vin(Min)(V): 4.3; ComponentLink1URL: http://www.ti.com/general/docs/lit/getliterature.tsp?genericPartNumber=BQ24075&fileType=pdf; Over Voltage Protection: N; PackageDescription: 16-Pin Plastic Quad Flat No-Lead, 3 x 3 mm Body, 0.5 mm Pitch, 1.7 x 1.7 mm Exposed Pad; NiMH: N; Li-Polymer: N; Eco-Plan: Green (RoHS & no Sb/Br); Code_JEDEC: MO-220; Lead Acid: N; PartNumber: BQ24075RGTRG4; ComponentLink1Description: Datasheet; Mounting Technology: Surface Mount; PackageVersion: revH, Oct-2011; PackageReference: RGT16-1700X1700TP; NiCd: N; DatasheetVersion: SLUS810G

## Sheet 6v_BOOST.SchDoc: 6v_BOOST.SchDoc
size 558 x 431 mm; Date: 2/16/2022; Author: Xitong Zheng, Hongliang Chen; SheetNumber: 10; SheetTotal: 11
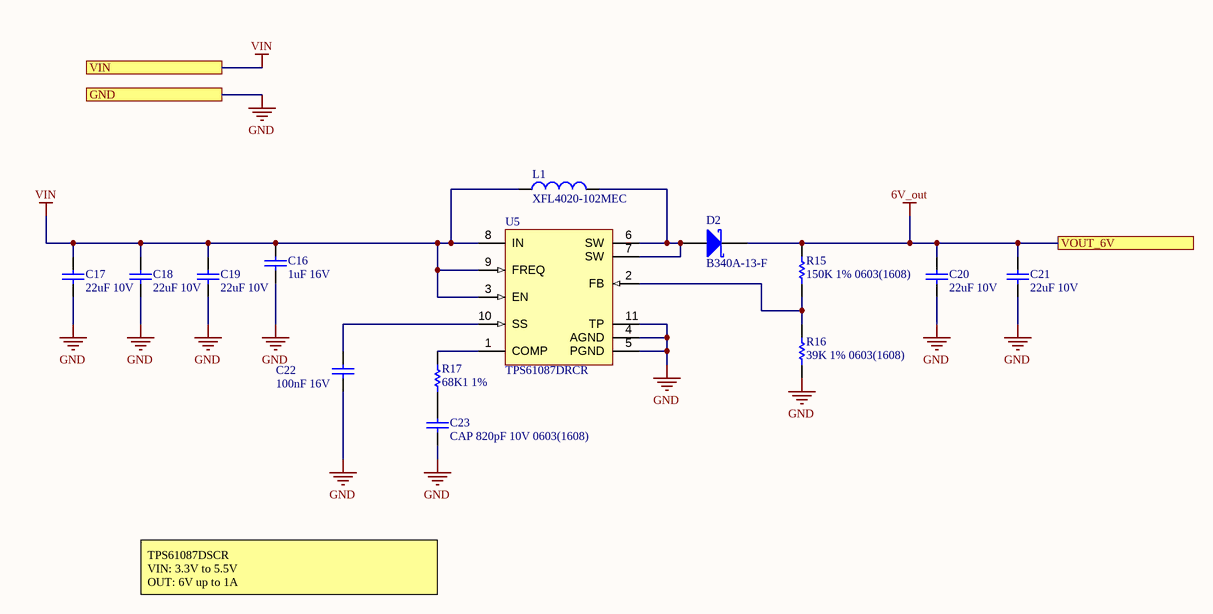
[diagram p5: 6v_BOOST.SchDoc]

### Parts
C16  1uF 16V  [CAPC0603(1608)100_N]
C17  22uF 10V  [CAPC0805(2012)145_N]
C18  22uF 10V  [CAPC0805(2012)145_N]
C19  22uF 10V  [CAPC0805(2012)145_N]
C20  22uF 10V  [CAPC0805(2012)145_N]
C21  22uF 10V  [CAPC0805(2012)145_N]
C22  100nF 16V  [CAPC0603(1608)100_N]
C23  CAP 820pF 10V 0603(1608)  [CAPC0603(1608)100_N]
D2  B340A-13-F  [DIOD-SMA-2_V]
L1  XFL4020-102MEC  [COIL-XFL4020_V]
R15  150K 1% 0603(1608)  [RESC0603(1608)_N]
R16  39K 1% 0603(1608)  [RESC0603(1608)_N]
R17  68K1 1%  [RESC0603(1608)_N]
U5  TPS61087DRCR  [DRC0010J_V]

### Ports
GND, VIN, VOUT_6V

### Nets
6V_out: C20.2 C21.2 D2.2(K) R15.2 ; port VOUT_6V
GND: C16.1 C17.1 C18.1 C19.1 C20.1 C21.1 C22.1 C23.1 R16.1 U5.4(AGND) U5.5(PGND) U5.11(TP) ; port GND
VIN: C16.2 C17.2 C18.2 C19.2 L1.1 U5.3(EN) U5.8(IN) U5.9(FREQ) ; port VIN  [project net VOUT]
NetC22_2: C22.2 U5.10(SS)
NetC23_2: C23.2 R17.1
NetD2_1: D2.1(A) L1.2 U5.6(SW) U5.7(SW)
NetR15_1: R15.1 R16.2 U5.2(FB)
NetR17_2: R17.2 U5.1(COMP)

### Notes on the sheet
- TPS61087DSCR
  VIN: 3.3V to 5.5V
  OUT: 6V up to 1A
- DWG. NO.
- REV.
- SHT.
- REVISION
- DESCRIPTION
- DATE
- APPROVED
- THIS DOCUMENT AND THE DATA DISCLOSED HEREIN OR HEREWITH IS THE PROPERTY OF ALTIUM LIMITED AND MAY BE FREELY DISTRIBUTED IN WHOLE. NO RIGHTS ARE RESERVED OR EXPRESS OR IMPLIED WARANTEE GIVEN.
- ENG:
- DSN:
- APPROVALS
- PROJECT
- DOCUMENT REVISION:
- DESIGN ITEM:
- CHK:
- BOM:
- REFERENCE DOCUMENTS
- PROJECT REVISION:
- TITLE
- FAB DWG:
- PCB DWG:
- ASSY DWG:
- SCALE:
- SIZE
- C
- CAGE CODE
- FILE NAME
- DWG NO.
- SHEET
- OF
- REV

### Library data of the parts
C16 = CMP-1035-02736-1: as C12 on sheet MCU; Technology: SMT; Max Thickness: 1 mm; Rated Voltage: 16 V; Value: 1uF
C17-C21 = CMP-1036-04943-1: CAP 22uF 10V ±20% 0805 (2012 Metric) Thickness 1.45mm SMD; Case-Metric: 2012; Case-EIA: 0805; Tolerance: Â±20%; Rated Voltage: 10 V; Max Thickness: 1.45 mm; Technology: SMT; Value: 22uF
C22 = CMP-1035-02584-1: as C1 on sheet FTDI; Technology: SMT; Max Thickness: 1 mm; Value: 100nF; Rated Voltage: 16 V
C23 = CMP-1035-01821-1: CAP 820pF 10V ±10% 0603 (1608 Metric) Thickness 1mm SMD; Case-EIA: 0603; Case-Metric: 1608; Tolerance: Â±10%; Max Thickness: 1 mm; Rated Voltage: 10 V; Technology: SMT; Value: 820pF
D2 = CMP-1667-00003-1: Surface Mount Schottky Barrier Rectifier, 40 V, 3 A, -55 to 150 degC, 2-Pin SMA, RoHS, Tape and Reel; Forward Current: 3 A; Forward Voltage: 500 mV; Max Surge Current: 80 A; Peak Reverse Current: 500 uA; Elements: 1; Mounting Technology: Surface Mount; ComponentLink1URL: http://www.diodes.com/; PackageDescription: 2-Pin Surface Mounted Assembly, Body 4.3 x 2.605 mm, Height 2.4 mm; Min Operating Temperature: -55 degC; Mount: Surface Mount; Pins: 2; ComponentLink2URL: http://www.diodes.com/_files/datasheets/ds30891.pdf; PackageReference: SMA-2; Max Operating Temperature: 125 degC; Radiation Hardening: No; Length: 4.6 mm; RoHSCompliant: true; ComponentLink1Description: Manufacturer URL; Height: 2.1 mm; ComponentLink2Description: Datasheet; Packaging: Tape and Reel; Package Quantity: 5000; Case\Package: SMA; DatasheetVersion: Rev. 17 - 2, 09/2015; REACH SVHC: No SVHC; Width: 2.92 mm
L1 = CMP-2000-07423-1: Shielded Power Inductor, 1 uH, 64 MHz, -40 to 125 degC, 2-Pin SMD, RoHS, Tape and Reel; Manufacturer: Coilcraft; Case Width: 4.3mm; Case Height: 2.1mm; Maximum DC Current: 11A; Core Material: Composite; Test Frequency: 100kHz; Tolerance: 20%; Maximum DC Resistance: 11.9mOhms; Inductance: 1uH; Self Resonant Frequency: 64MHz; RoHS: Details; Series: XFL4020; Case Length: 4.3mm; Package Reference: XFL4020; Dimensions: 4.3mmWx4.3mmLx2.1mmH; Product: PowerInductors; Datasheet Version: 07/2012; Manufacturer URL: http://www.coilcraft.com/; Termination Style: SMD/SMT; Mounting Technology: SurfaceMount; Operating Temperature Range: -40Cto+125C; Package Description: 2-Pin Surface Mount Device, Body 4 x 4 mm, Pitch 2.37 mm; Shielding: Shielded; Packaging: Reel; Datasheet URL: http://www.mouser.com/ds/2/597/xfl4020-270756.pdf
R15 = CMP-1012-00754-1: 150K 0.1W 1% 0603 (1608 Metric)  SMD; Case-EIA: 0603; Case-Metric: 1608; Value: 150000.00 Ohm; Tolerance: 1 %; Power: 0.1 W; Technology: SMT
R16 = CMP-1012-00689-1: 39K 0.1W 1% 0603 (1608 Metric)  SMD; Case-Metric: 1608; Case-EIA: 0603; Value: 39000.00 Ohm; Technology: SMT; Tolerance: 1 %; Power: 0.1 W
R17 = CMP-1012-00718-1: 68K1 0.1W 1% 0603 (1608 Metric)  SMD; Case-EIA: 0603; Case-Metric: 1608; Value: 68100.00 Ohm; Technology: SMT; Power: 0.1 W; Tolerance: 1 %
U5 = CMP-0343-00035-2: Boost Voltage Converter with 2.5 to 6 V Input and 3 to 18.5 V Output, -40 to 85 degC, 10-Pin SON (DRC), Green (RoHS & no Sb/Br); Manufacturer: Texas Instruments; Vout(Max)(V): 18.5; Switching Frequency(Typ)(kHz): 650, 1200; SubFamily: Step-Up Regulator; Regulated Outputs(#): 1; Vout(Min)(V): 3; Vin(Min)(V): 2.5; Vin(Max)(V): 6; PartNumber: TPS61087DRCR; ComponentLink1Description: Datasheet; Mounting Technology: Surface Mount; Eco-Plan: Green (RoHS & no Sb/Br); Topology: Boost; PackageVersion: revL, Sep-2011; DatasheetVersion: SLVS821B; ComponentLink1URL: http://www.ti.com/general/docs/lit/getliterature.tsp?genericPartNumber=TPS61087&fileType=pdf; ComponentLink2URL: http://www.ti.com/litv/pdf/mpds117k; ComponentLink2Description: Package Specification; PackageDescription: 10-Pin Plastic Small Outline No-Lead, 3 x 3 x 1 mm Body, 0.5 mm Pitch, Exposed Pad; PackageReference: DRC0010J

## Sheet BME680.SchDoc: BME680.SchDoc
size 558 x 431 mm; Date: 2/16/2022; Author: Xitong Zheng, Hongliang Chen; SheetNumber: 3; SheetTotal: 11
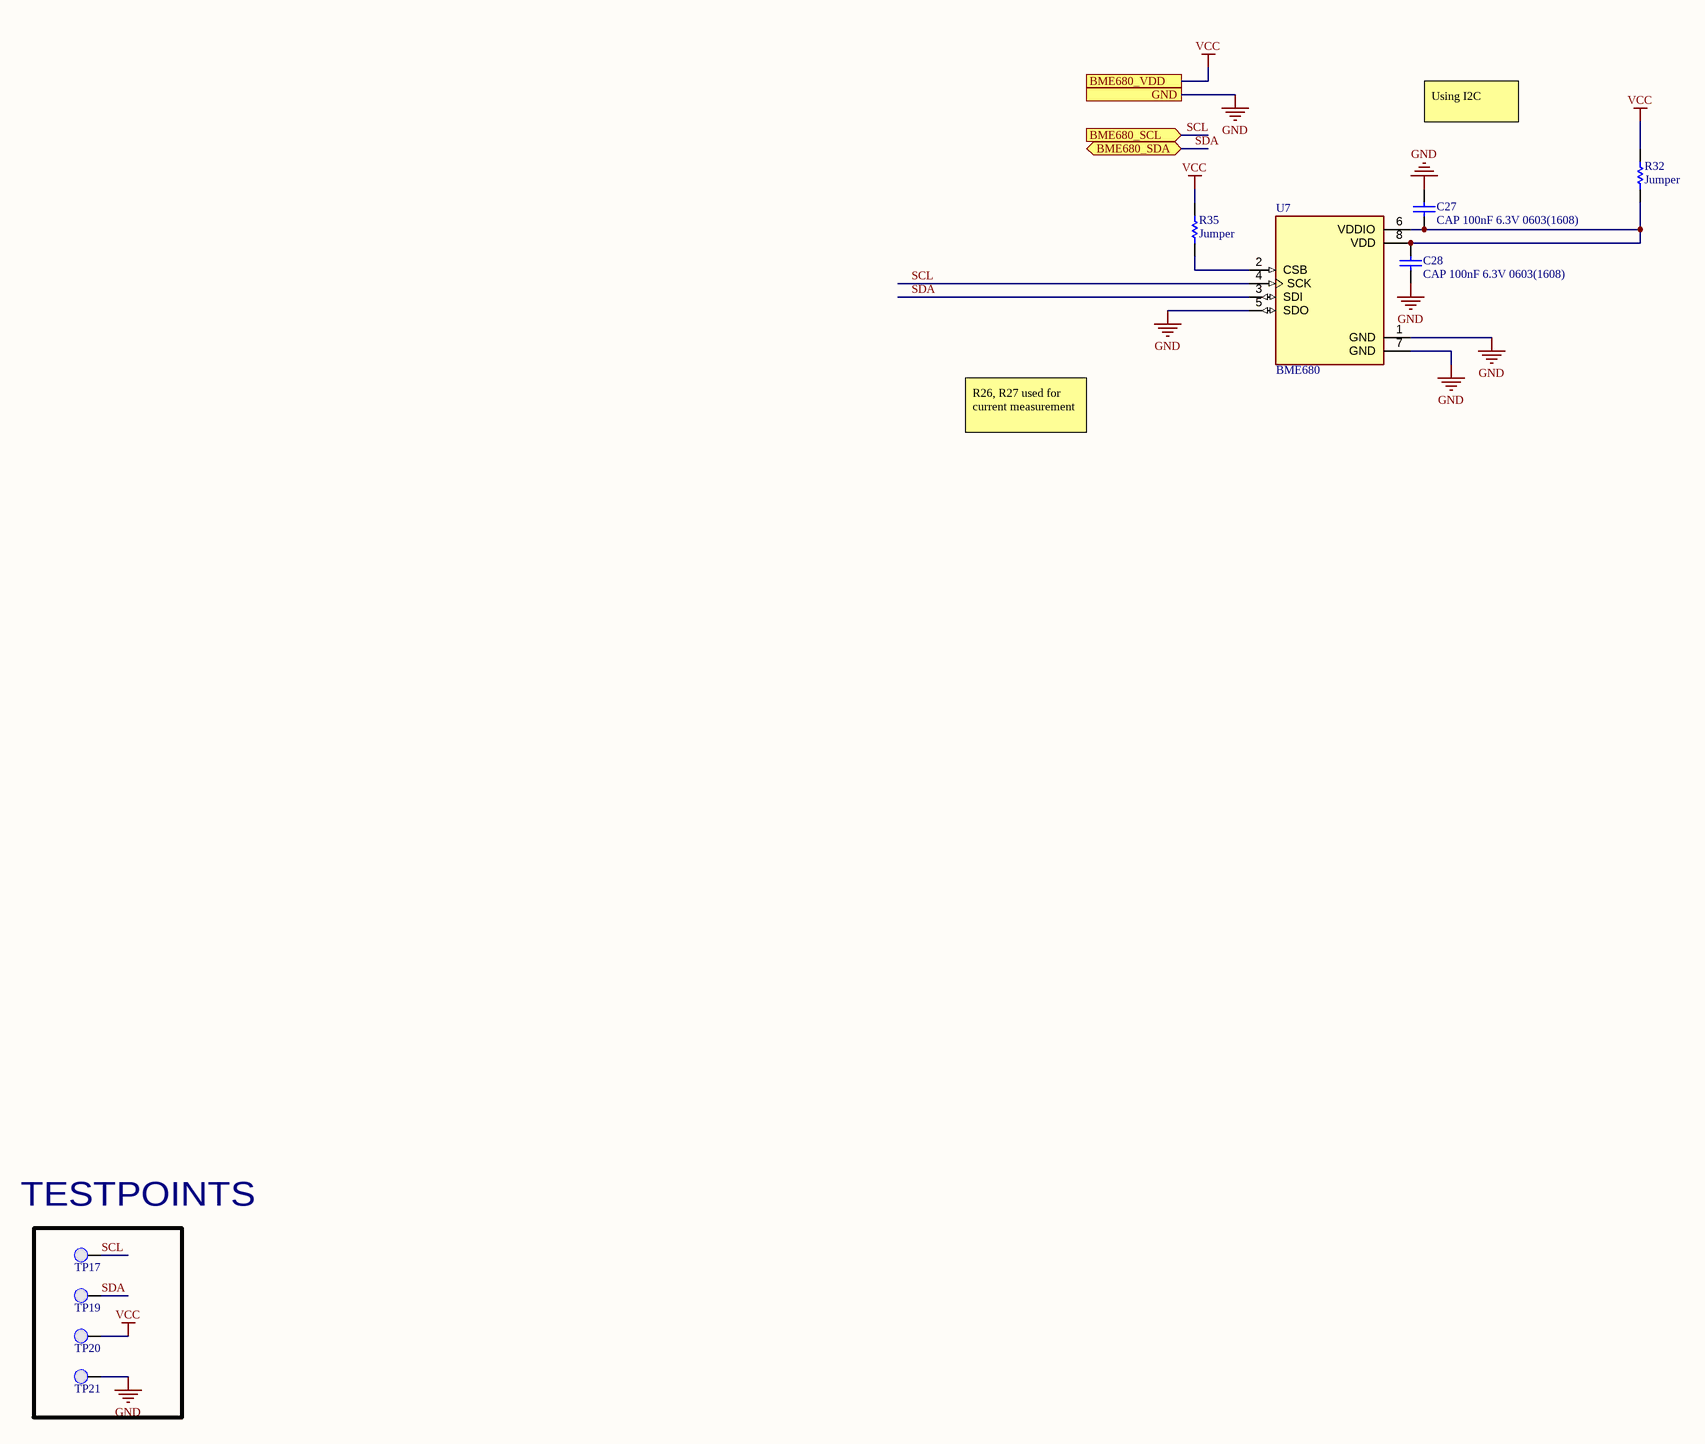
[diagram p6: BME680.SchDoc]

### Parts
C27  CAP 100nF 6.3V 0603(1608)  [CAPC0603(1608)100_M]
C28  CAP 100nF 6.3V 0603(1608)  [CAPC0603(1608)100_M]
R32  Jumper  [RESC0603(1608)_N]
R35  Jumper  [RESC0603(1608)_N]
TP17  0.1" Pad  [PCBComponent]  (value not drawn)
TP19  0.1" Pad  [PCBComponent]  (value not drawn)
TP20  0.1" Pad  [PCBComponent]  (value not drawn)
TP21  0.1" Pad  [PCBComponent]  (value not drawn)
U7  BME680  [PSON80P300X300X100-8N]

### Ports
BME680_SCL (in), BME680_SDA (bidir), BME680_VDD, GND

### Nets
GND: C27.1 C28.1 TP21.1(PAD) U7.1(GND) U7.5(SDO) U7.7(GND) ; port GND
VCC: R32.2 R35.2 TP20.1(PAD) ; port BME680_VDD  [project net 3V3]
SCL: TP17.1(PAD) U7.4(SCK) ; port BME680_SCL
SDA: TP19.1(PAD) U7.3(SDI) ; port BME680_SDA
NetC27_2: C27.2 C28.2 R32.1 U7.6(VDDIO) U7.8(VDD)
NetR35_1: R35.1 U7.2(CSB)

### Notes on the sheet
- Using I2C
- R26, R27 used for current measurement
- (near TP17) TESTPOINTS
- DWG. NO.
- REV.
- SHT.
- REVISION
- DESCRIPTION
- DATE
- APPROVED
- THIS DOCUMENT AND THE DATA DISCLOSED HEREIN OR HEREWITH IS THE PROPERTY OF ALTIUM LIMITED AND MAY BE FREELY DISTRIBUTED IN WHOLE. NO RIGHTS ARE RESERVED OR EXPRESS OR IMPLIED WARANTEE GIVEN.
- ENG:
- DSN:
- APPROVALS
- PROJECT
- DOCUMENT REVISION:
- DESIGN ITEM:
- CHK:
- BOM:
- REFERENCE DOCUMENTS
- PROJECT REVISION:
- TITLE
- FAB DWG:
- PCB DWG:
- ASSY DWG:
- SCALE:
- SIZE
- C
- CAGE CODE
- FILE NAME
- DWG NO.
- SHEET
- OF
- REV

### Library data of the parts
C27 C28 = CMP-1035-02575-1: CAP 100nF 6.3V ±5% 0603 (1608 Metric) Thickness 1mm SMD; Tolerance: Â±5%; Case-Metric: 1608; Case-EIA: 0603; Technology: SMT; Rated Voltage: 6.3 V; Max Thickness: 1 mm; Value: 100nF
R32 R35 = CMP-1012-00001-1: as R4 on sheet FTDI; Technology: SMT; Tolerance: None
TP17 TP19-TP21 = 0.1" Pad-A.4
U7 = BME680: Integrated Environmental Unit; MF: {'manufacturer': u'Bosch Sensortec'}; Value: *; Package: None; Availability: Unavailable; MP: BME680; Price: None

## Sheet APDS9960.SchDoc: APDS9960.SchDoc
size 558 x 431 mm; Date: 2/16/2022; Author: Xitong Zheng, Hongliang Chen; SheetNumber: 2; SheetTotal: 11
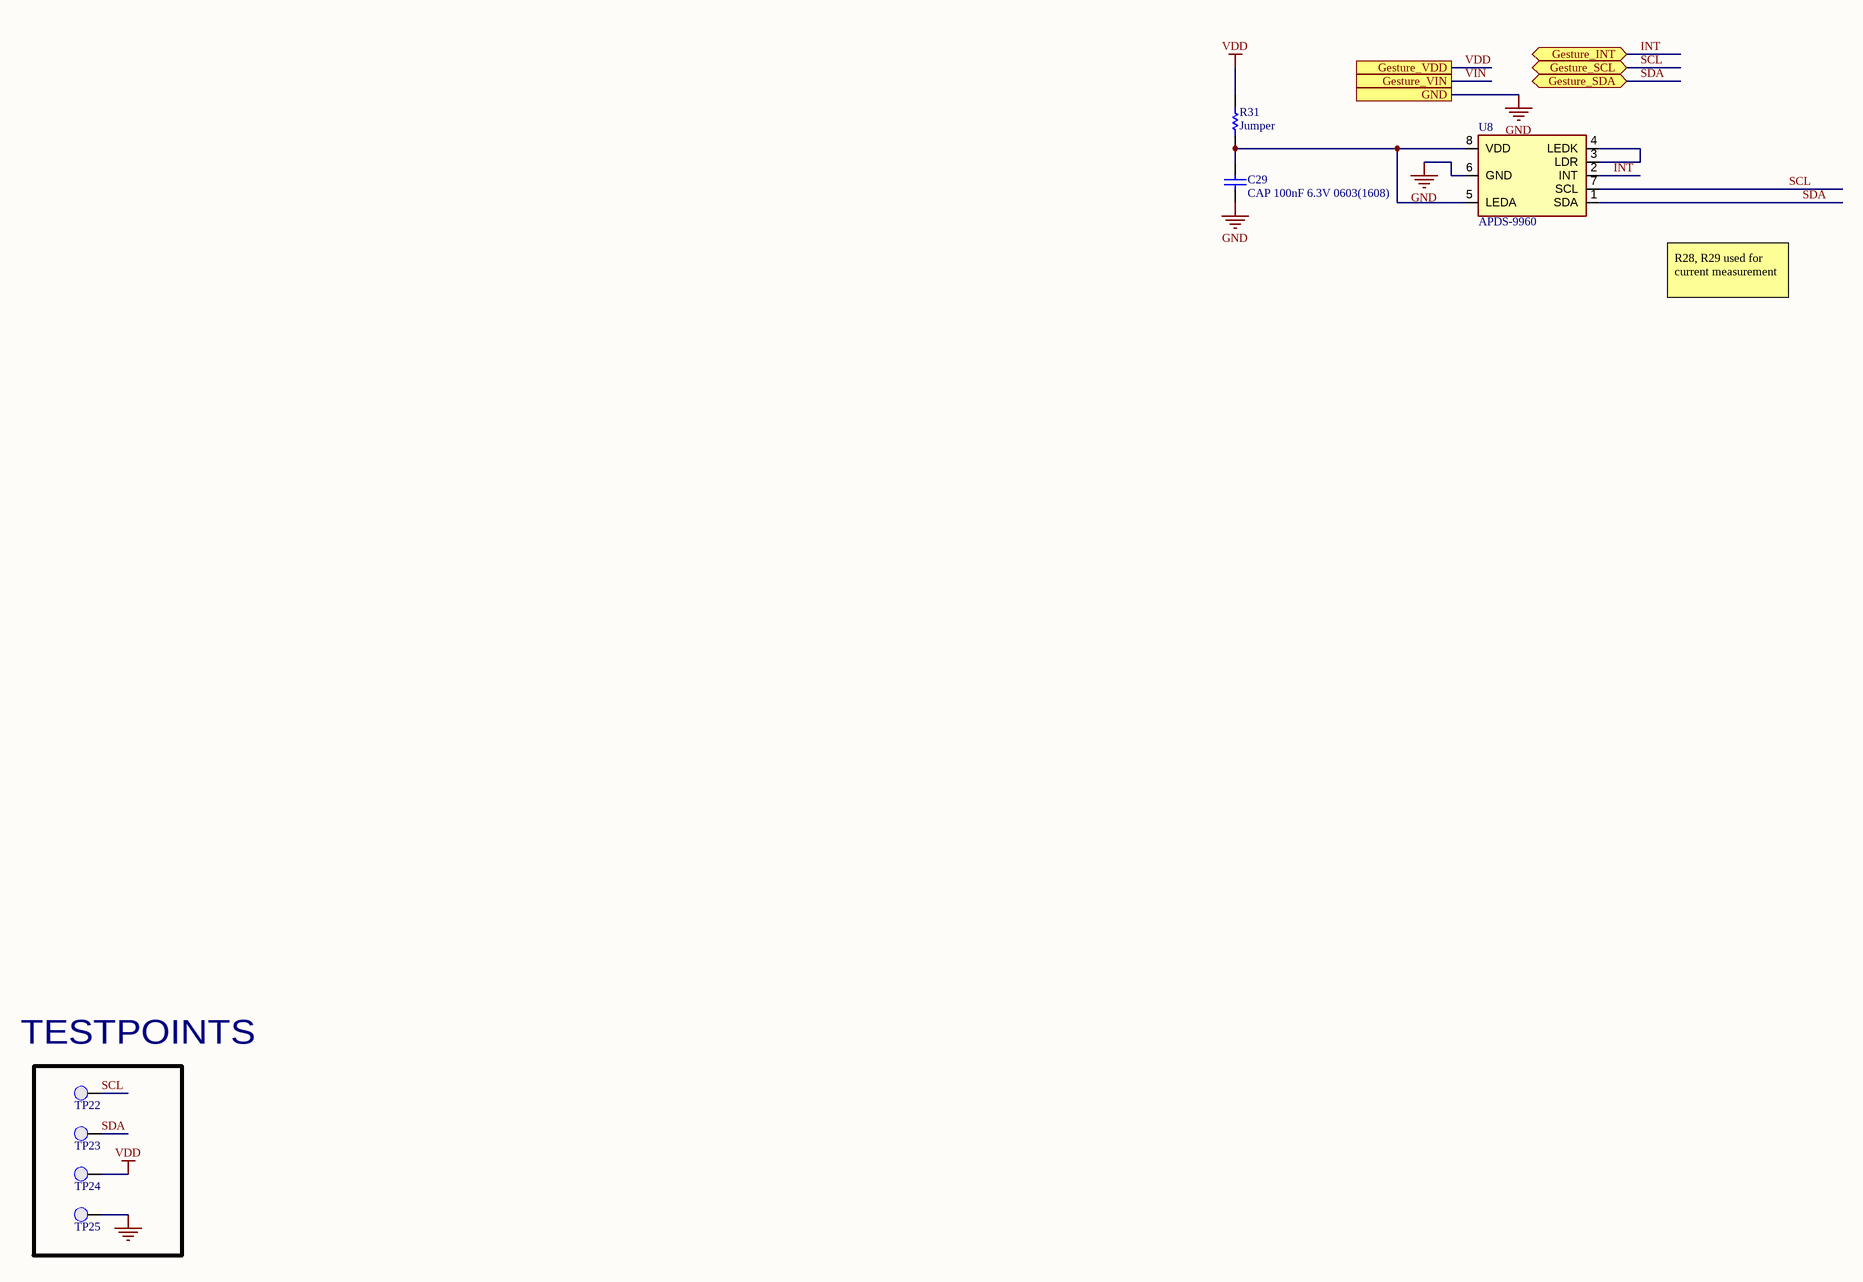
[diagram p7: APDS9960.SchDoc]

### Parts
C29  CAP 100nF 6.3V 0603(1608)  [CAPC0603(1608)100_M]
R31  Jumper  [RESC0603(1608)_N]
TP22  0.1" Pad  [PCBComponent]  (value not drawn)
TP23  0.1" Pad  [PCBComponent]  (value not drawn)
TP24  0.1" Pad  [PCBComponent]  (value not drawn)
TP25  0.1" Pad  [PCBComponent]  (value not drawn)
U8  APDS-9960  [APDS-9960]

### Ports
Gesture_INT (bidir), Gesture_SCL (bidir), Gesture_SDA (bidir), Gesture_VDD, Gesture_VIN, GND

### Nets
GND: C29.2 TP25.1(PAD) U8.6(GND) ; port GND
VDD: R31.1 TP24.1(PAD) ; port Gesture_VDD, port Gesture_VIN  [also labelled VIN]  [project net 3V3]
INT: U8.2(INT) ; port Gesture_INT
SCL: TP22.1(PAD) U8.7(SCL) ; port Gesture_SCL
SDA: TP23.1(PAD) U8.1(SDA) ; port Gesture_SDA
NetC29_1: C29.1 R31.2 U8.5(LEDA) U8.8(VDD)
NetU8_3: U8.3(LDR) U8.4(LEDK)

### Notes on the sheet
- R28, R29 used for current measurement
- (near TP22) TESTPOINTS
- DWG. NO.
- REV.
- SHT.
- REVISION
- DESCRIPTION
- DATE
- APPROVED
- THIS DOCUMENT AND THE DATA DISCLOSED HEREIN OR HEREWITH IS THE PROPERTY OF ALTIUM LIMITED AND MAY BE FREELY DISTRIBUTED IN WHOLE. NO RIGHTS ARE RESERVED OR EXPRESS OR IMPLIED WARANTEE GIVEN.
- ENG:
- DSN:
- APPROVALS
- PROJECT
- DOCUMENT REVISION:
- DESIGN ITEM:
- CHK:
- BOM:
- REFERENCE DOCUMENTS
- PROJECT REVISION:
- TITLE
- FAB DWG:
- PCB DWG:
- ASSY DWG:
- SCALE:
- SIZE
- C
- CAGE CODE
- FILE NAME
- DWG NO.
- SHEET
- OF
- REV

### Library data of the parts
C29 = CMP-1035-02575-1: as C27 on sheet BME680; Technology: SMT; Rated Voltage: 6.3 V; Max Thickness: 1 mm; Value: 100nF
R31 = CMP-1012-00001-1: as R4 on sheet FTDI; Technology: SMT; Tolerance: None
TP22-TP25 = 0.1" Pad-A.4
U8 = APDS-9960: <h3>Avago APDS-9960 Digital Proximity, Ambient Light, RGB, and Gesture Sensor.</h3> <p>The APDS-9960 offers ambient light and color measuring, proximity detection, and touchless gesture sensing. It features UV and IR blocking filters, four separate diodes sensitive to different directions, and an I2C compatible interface.</p> <p><a href="https://cdn.sparkfun.com/datasheets/Sensors/Proximity/apds9960.pdf">Datasheet</a></p> <h4>SparkFun Products</h4> <ul> <li><a href="https://www.sparkfun.com/products/12787">SparkFun RGB and Gesture Sensor - APDS-9960</a> (SEN-12787)</li> </ul>; MF: {'manufacturer': u'Broadcom Limited'}; Value: *; Package: None; Availability: Unavailable; MP: APDS-9960; Price: None

## Sheet 3.3V_BUCK.SchDoc: 3.3v_Buck.SchDoc
size 558 x 431 mm; Date: 2/16/2022; Author: Xitong Zheng, Hongliang Chen; SheetNumber: 4; SheetTotal: 11
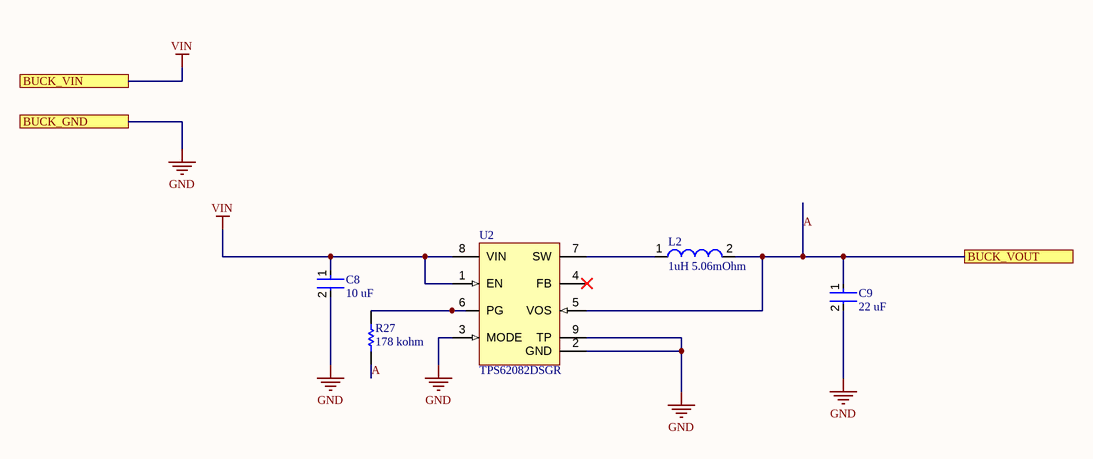
[diagram p8: 3.3V_BUCK.SchDoc]

### Parts
C8  10 uF  [FP-GRJ155-0_2-MFG]
C9  22 uF  [FP-GRM21B-0_2-e0_2_0_7-IPC_B]
L2  1uH 5.06mOhm  [WE-HCI-7040]
R27  178 kohm  [RESC2013X70X40ML20T20]
U2  TPS62082DSGR  [DSG0008A_V]

### Ports
BUCK_GND, BUCK_VIN, BUCK_VOUT

### Nets
GND: C8.2 C9.2 U2.2(GND) U2.3(MODE) U2.9(TP) ; port BUCK_GND
VIN: C8.1 U2.1(EN) U2.8(VIN) ; port BUCK_VIN  [project net VOUT]
A: C9.1 L2.2 R27.1 U2.5(VOS) ; port BUCK_VOUT
NetL2_1: L2.1 U2.7(SW)
NetR27_2: R27.2 U2.6(PG)

Not connected (* = marked no-connect by the designer): U2 4(FB)*

### Notes on the sheet
- DWG. NO.
- REV.
- SHT.
- REVISION
- DESCRIPTION
- DATE
- APPROVED
- THIS DOCUMENT AND THE DATA DISCLOSED HEREIN OR HEREWITH IS THE PROPERTY OF ALTIUM LIMITED AND MAY BE FREELY DISTRIBUTED IN WHOLE. NO RIGHTS ARE RESERVED OR EXPRESS OR IMPLIED WARANTEE GIVEN.
- ENG:
- DSN:
- APPROVALS
- PROJECT
- DOCUMENT REVISION:
- DESIGN ITEM:
- CHK:
- BOM:
- REFERENCE DOCUMENTS
- PROJECT REVISION:
- TITLE
- FAB DWG:
- PCB DWG:
- ASSY DWG:
- SCALE:
- SIZE
- C
- CAGE CODE
- FILE NAME
- DWG NO.
- SHEET
- OF
- REV

### Library data of the parts
C8 = CMP-06035-062410-1: CAP CER 10UF 6.3V X5R 0402; Tolerance: 20%; Length: 0.039inch; Width: 0.02inch; Capacitance: 10uF; Max Operating Temperature: 85°C; Features: Soft Termination; Case Code (Metric): 1005; Min Operating Temperature: -55°C; Thickness: 0.028inch; Mount: Surface Mount; Packaging: Cut Tape; Case/Package: 0402; Voltage Rating: 6.3V; Case Code (Imperial): 0402; RoHS Compliant: Yes
C9 = CMP-06035-048447-1: Chip Multilayer Ceramic Capacitors for General Purpose, 0805, 22uF, X7T, +22%/-33%, 20%, 6.3V; Case Code (Imperial): 0805; Capacitance: 22uF; Mount: Surface Mount; Packaging: Tape and Reel; Voltage Rating: 6.3V; Height: 1.25mm; Voltage Rating (DC): 6.3V; Case/Package: 0805; Weight: 0.000335oz; Dielectric: X7T; Length: 0.079inch; Width: 1.25mm; Package Quantity: 3000; Thickness: 0.057inch; Tolerance: 20%; Min Operating Temperature: -55°C; Case Code (Metric): 2012; Termination: SMD/SMT; Max Operating Temperature: 125°C; Resistor Type: Ceramic
L2 = CMP-0226-00067-1: SMD Flat Wire High Current Inductor WE-HCI, L=1.00 µH; Inductance: 1.00 ÂµH; PackageReference: WE-HCI-7040; ComponentLink2Description: Datasheet; ComponentLink1Description: Manufacturer Link; PackageVersion: 2008; ComponentLink2URL: http://www.we-online.de/katalog/media/pdf/744311100.pdf; DatasheetVersion: ver 1, Feb-2008; PackageDescription: SMD Inductor, 2-Leads, Body 7.0 x 6.9 mm; ComponentLink1URL: http://www.we-online.com
R27 = CMP-2001-00007-1: Part Number: ERJ-6ENF1783V; Manufacturer: Panasonic
U2 = CMP-0323-00344-3: Buck Step Down Regulator with 2.3 to 6 V Input and 3.3 V Output, -40 to 85 degC, 8-Pin WSON (DSG), Green (RoHS & no Sb/Br); Manufacturer: Texas Instruments; Switch Current Limit(Typ)(A): 2.4; Vin(Min)(V): 2.3; Iq(Typ)(mA): 0.006; Regulated Outputs(#): 1; Vout(Max)(V): 3.3; Duty Cycle(Max)(%): 100; Iout(Max)(A): 1.2; SubFamily: Step-Down Regulator; Rating: Catalog; Vin(Max)(V): 6; ComponentLink1Description: Datasheet; ComponentLink3Description: URL Link1; ComponentLink2URL: http://www.ti.com/litv/pdf/mpds308a; DatasheetVersion: SLVSAE8B; PackageVersion: revB, Oct-2010; Eco-Plan: Green (RoHS & no Sb/Br); ComponentLink2Description: Package Specification; PackageReference: DSG0008A; Code_JEDEC: MO-229; Topology: Buck; PartNumber: TPS62082DSGR; PackageDescription: 8-Pin Plastic Small Outline No-Lead, 2 x 2 x 0.8 mm Body, 0.5 mm Pitch, Exposed Pad; ComponentLink1URL: http://www.ti.com/general/docs/lit/getliterature.tsp?genericPartNumber=TPS62082&fileType=pdf; ComponentLink3URL: Samples URL:http://www.ti.com/product/tps62082#samples; Vout(Min)(V): 3.3; Mounting Technology: Surface Mount